# Altium project Relia ver2.PrjPcb (part 1 of 2)
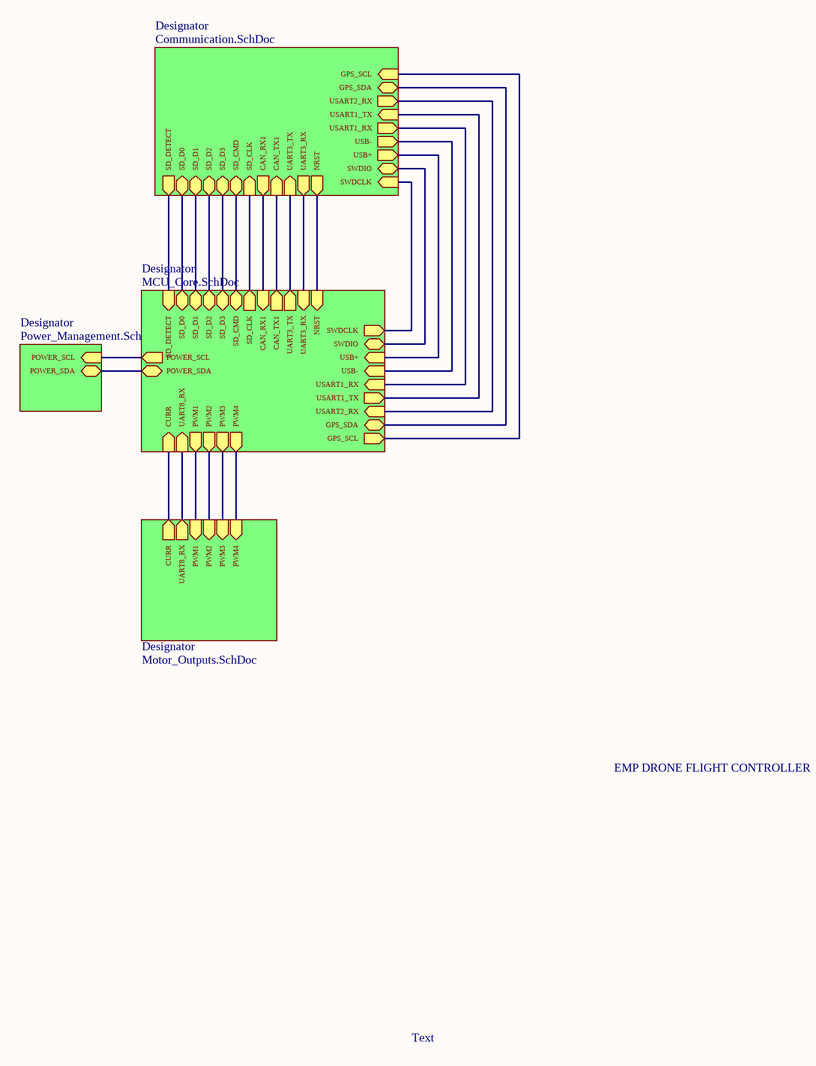
[diagram p0: EMP_FC_Main.SchDoc]
5 sheets, 143 parts. Net scope: hierarchical (ports join the sheet entries above them; power ports are global).
Board files: RELIA.PcbDoc, Relia_6_Layer.PcbDoc
Sheets:
  EMP_FC_Main.SchDoc
    Designator = Power_Management.SchDoc
    Designator = MCU_Core.SchDoc
    Designator = Communication.SchDoc
    Designator = Motor_Outputs.SchDoc

## Sheet EMP_FC_Main.SchDoc
size A4; SheetNumber: 1; SheetTotal: 5

### Sub-sheets
Designator = Power_Management.SchDoc: POWER_SCL (in), POWER_SDA (bidir)
Designator = MCU_Core.SchDoc: PWM4 (out), CURR (in), UART8_RX (in), PWM1 (out), PWM2 (out), PWM3 (out), NRST (in), UART3_RX (in), UART3_TX (out), CAN_TX1 (out), CAN_RX1 (in), SD_CMD (bidir), SD_CLK (out), SD_D3 (bidir), SD_D2 (bidir), SD_D1 (bidir), SD_D0 (bidir), POWER_SCL (out), POWER_SDA (bidir), SWDCLK (out), SWDIO (bidir), USB+ (in), USB- (in), USART1_RX (in), USART1_TX (out), USART2_RX (in), GPS_SDA (bidir), GPS_SCL (out), SD_DETECT (in)
Designator = Communication.SchDoc: SD_D0 (bidir), SD_D1 (bidir), SD_D2 (bidir), SD_D3 (bidir), SD_CMD (bidir), SD_CLK (in), CAN_RX1 (out), CAN_TX1 (in), UART3_TX (in), UART3_RX (out), NRST (out), USART2_RX (out), SWDCLK (in), SWDIO (bidir), USB+ (out), USB- (out), USART1_RX (out), USART1_TX (in), GPS_SDA (bidir), GPS_SCL (in), SD_DETECT (out)
Designator = Motor_Outputs.SchDoc: PWM4 (in), CURR (out), UART8_RX (out), PWM1 (in), PWM2 (in), PWM3 (in)

### Nets
GPS_SCL: sheet Designator/GPS_SCL, sheet Designator/GPS_SCL
GPS_SDA: sheet Designator/GPS_SDA, sheet Designator/GPS_SDA
NRST: sheet Designator/NRST, sheet Designator/NRST
RX: sheet Designator/UART8_RX, sheet Designator/UART8_RX
SD_CLK: sheet Designator/SD_CLK, sheet Designator/SD_CLK
SD_CMD: sheet Designator/SD_CMD, sheet Designator/SD_CMD
SD_D1: sheet Designator/SD_D1, sheet Designator/SD_D1
SD_D2: sheet Designator/SD_D2, sheet Designator/SD_D2
SD_D3: sheet Designator/SD_D3, sheet Designator/SD_D3
SD_DETECT: sheet Designator/SD_DETECT, sheet Designator/SD_DETECT
SD_DO: sheet Designator/SD_D0, sheet Designator/SD_D0
SWCLK: sheet Designator/SWDCLK, sheet Designator/SWDCLK
SWDIO: sheet Designator/SWDIO, sheet Designator/SWDIO
UART3_RX: sheet Designator/UART3_RX, sheet Designator/UART3_RX
UART3_TX: sheet Designator/UART3_TX, sheet Designator/UART3_TX
USART1_RX: sheet Designator/USART1_RX, sheet Designator/USART1_RX
USART1_TX: sheet Designator/USART1_TX, sheet Designator/USART1_TX
USB_N: sheet Designator/USB-, sheet Designator/USB-
USB_P: sheet Designator/USB+, sheet Designator/USB+
NetC39_1: sheet Designator/CURR, sheet Designator/CURR
NetJ8_1: sheet Designator/POWER_SCL, sheet Designator/POWER_SCL
NetJ8_2: sheet Designator/POWER_SDA, sheet Designator/POWER_SDA
NetR11_1: sheet Designator/USART2_RX, sheet Designator/USART2_RX
NetR29_1: sheet Designator/PWM1, sheet Designator/PWM1
NetR30_1: sheet Designator/PWM2, sheet Designator/PWM2
NetR31_1: sheet Designator/PWM3, sheet Designator/PWM3
NetR32_1: sheet Designator/PWM4, sheet Designator/PWM4
NetU2_1: sheet Designator/CAN_TX1, sheet Designator/CAN_TX1
NetU2_4: sheet Designator/CAN_RX1, sheet Designator/CAN_RX1

### Notes on the sheet
- EMP DRONE FLIGHT CONTROLLER
- Text

## Sheet Power_Management.SchDoc
size A3; SheetNumber: 2; SheetTotal: 5
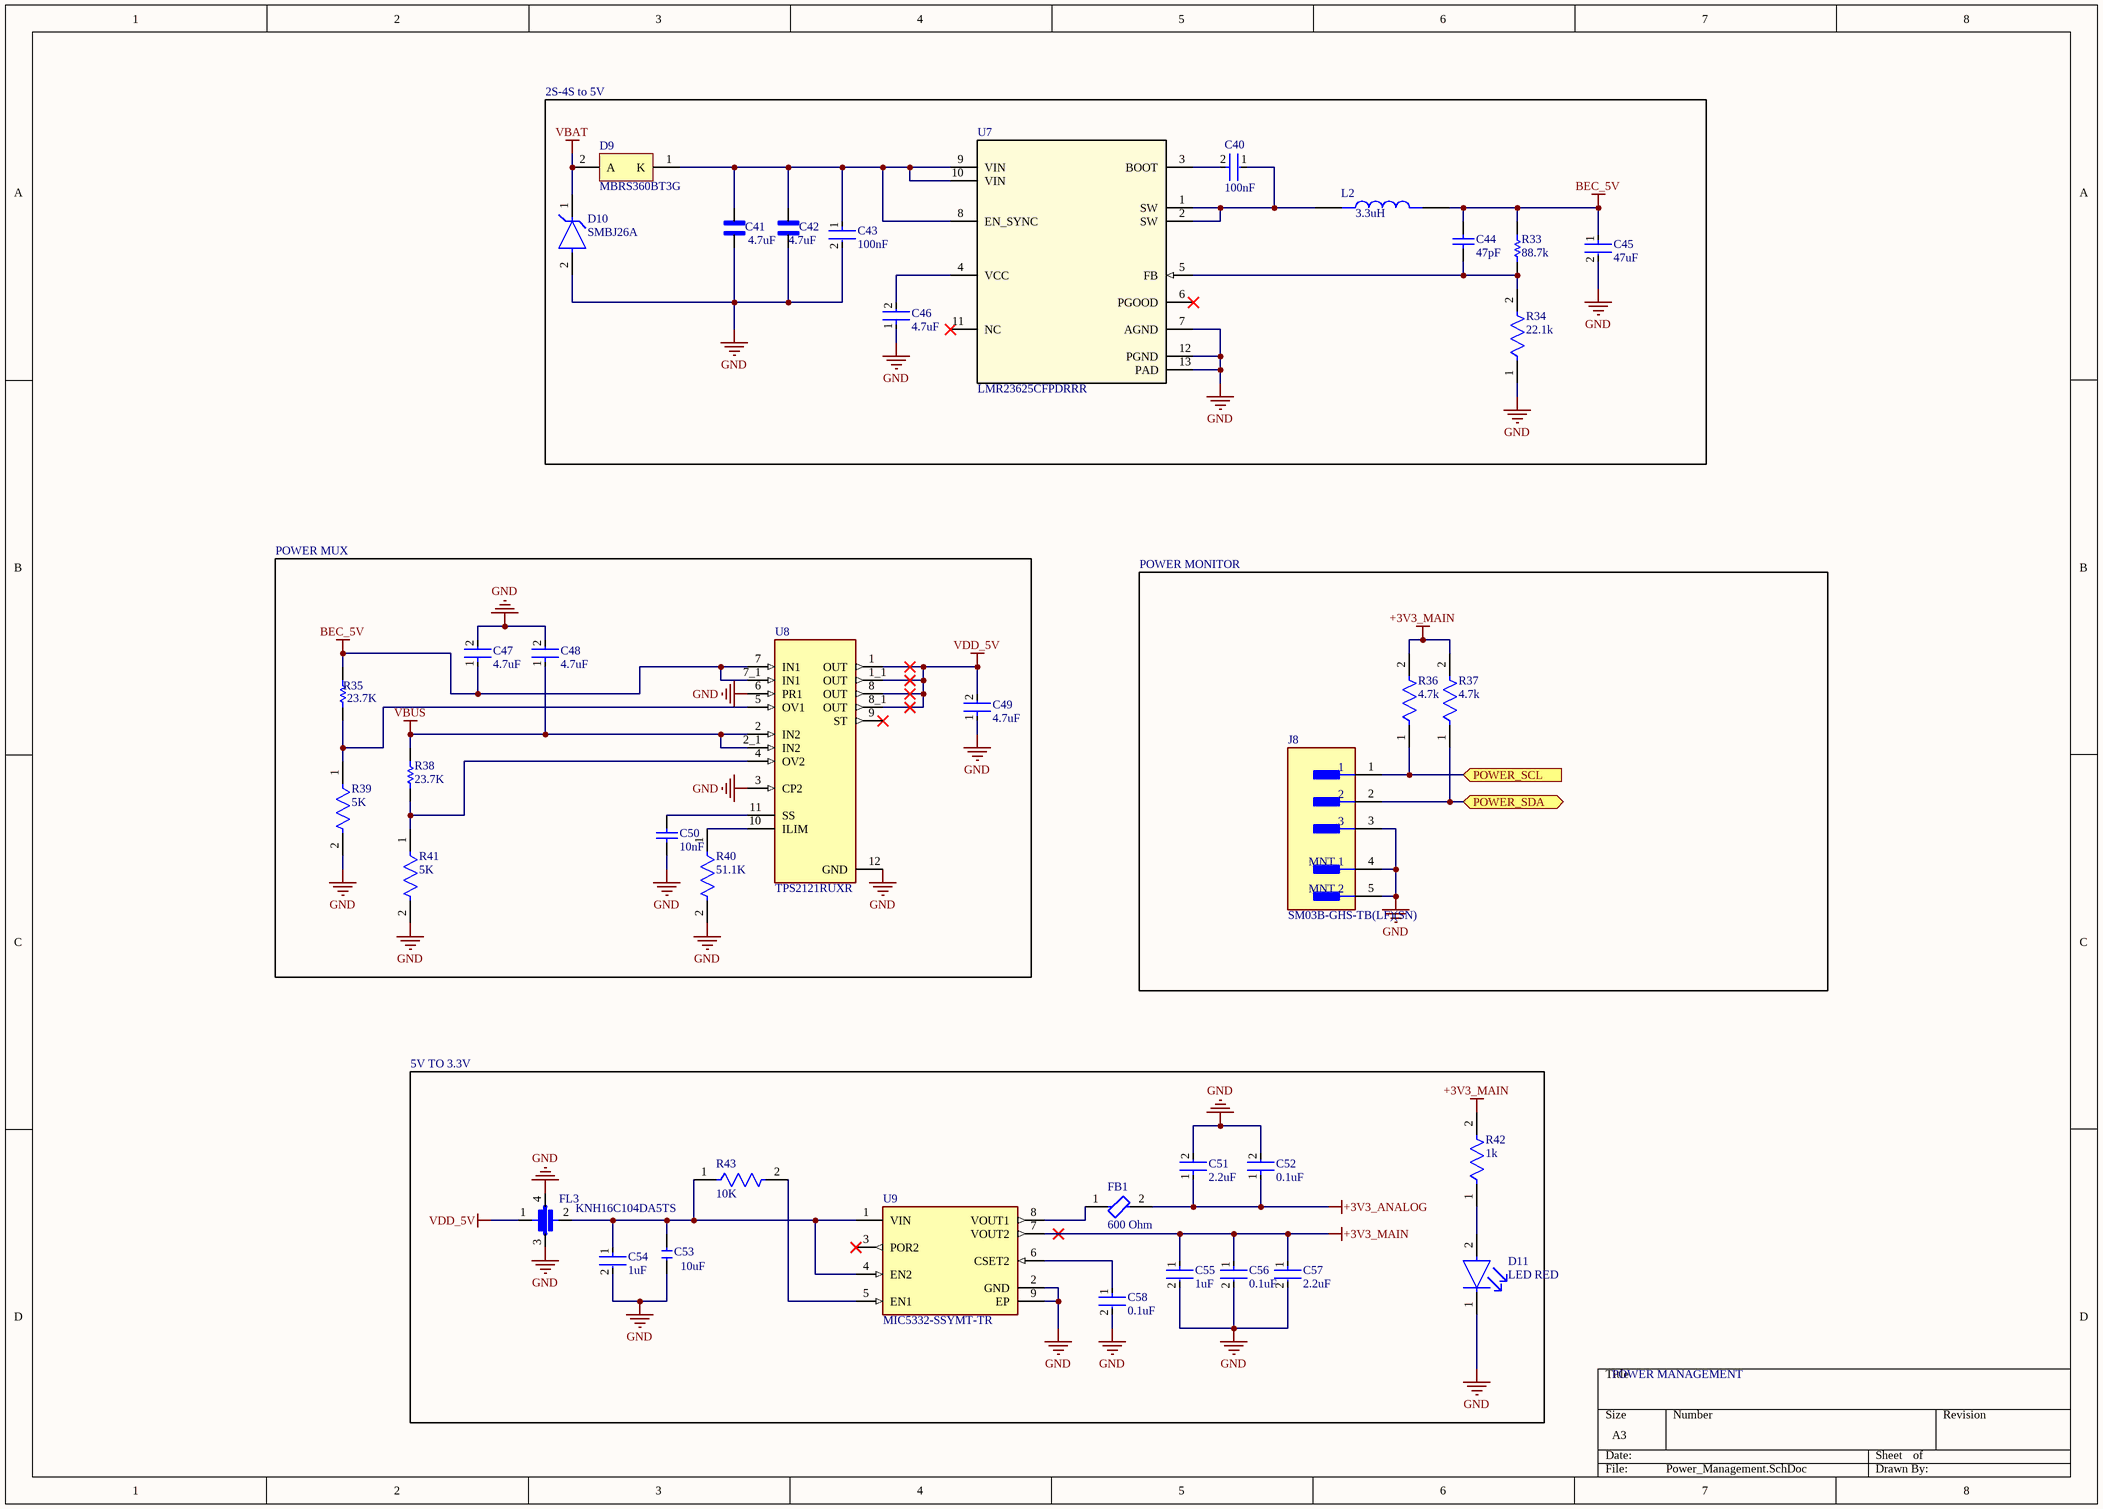
[diagram p1: Power_Management.SchDoc]

### Parts
C40  100nF  [FP-GRM15-MFG]
C41  MSASU32MSB7475MPNA01  [CAPC3225X270N]  (value not drawn)
C42  MSASU32MSB7475MPNA01  [CAPC3225X270N]  (value not drawn)
C43  100nF  [FP-CS0402-CA-MFG]
C44  47pF  [CAPC1005X55X25NL05T10]
C45  47uF  [FP-GRM31C-0_2-e0_3_0_8-IPC_A]
C46  4.7uF  [FP-GRT155-0_15-MFG]
C47  4.7uF  [FP-GRT155-0_15-MFG]
C48  4.7uF  [FP-GRT155-0_15-MFG]
C49  4.7uF  [FP-GRT155-0_15-MFG]
C50  10nF  [CAPC1005X60X30NL05T10]
C51  2.2uF  [FP-GRM155-0_2-IPC_B]
C52  0.1uF  [FP-C0402-BB-MFG]
C53  GRM155R60J106ME15D  [C0402]  (value not drawn)
C54  1uF  [FP-GRM155-0_1-IPC_A]
C55  1uF  [FP-GRM155-0_1-IPC_A]
C56  0.1uF  [FP-C0402-BB-MFG]
C57  2.2uF  [FP-GRM155-0_2-IPC_B]
C58  0.1uF  [FP-C0402-BB-MFG]
D9  MBRS360BT3G  [ONSC-SMB-2-403A-03_H_V]
D10  SMBJ26A  [FP-SMBJ-MFG]
D11  LED RED  [FP-SML-LXT0805IW-TR-MFG]
FB1  600 Ohm  [FP-BLM15-0_05-MFG]
FL3  KNH16C104DA5TS  [FIL_KNH16C104DA5TS]
J8  SM03B-GHS-TB(LF)(SN)  [FP-SM03B-GHS-TB_LF_SN-MFG]
L2  IND_XAL4030-332MEB  [IND_XAL4030-332MEB]  (value not drawn)
R33  88.7k  [RESC1005X40X25NL05T05]
R34  22.1k  [FP-CRCW0402-e3-IPC_A]
R35  23.7K  [RESC1005X40X25LL05T05]
R36  4.7k  [FP-TFCR0402-IPC_A]
R37  4.7k  [FP-TFCR0402-IPC_A]
R38  23.7K  [RESC1005X40X25LL05T05]
R39  5K  [FP-PNM0402-IPC_C]
R40  51.1K  [FP-RK73H1E-IPC_C]
R41  5K  [FP-PNM0402-IPC_C]
R42  1k  [FP-MCS0402-IPC_A]
R43  10K  [FP-MCS0402-MFG]
U7  LMR23625CFPDRRR  [DRR0012D]
U8  TPS2121RUXR  [IC_TPS2121RUXR]
U9  MIC5332-SSYMT-TR  [FP-MIC5332-SSYMT-TR-IPC_C]

### Blocks framed on the sheet
POWER MUX: C47-C50 R35 R38-R41 U8
POWER MONITOR: J8 R36 R37

### Ports
POWER_SCL (in, see EMP_FC_Main[2B], MCU_Core[1B]), POWER_SDA (bidir, see EMP_FC_Main[2C], MCU_Core[1B])

### Nets
+3V3_ANALOG: C51.1 C52.1 FB1.2
+3V3_MAIN: C55.1 C56.1 C57.1 R36.2 R37.2 R42.2 U9.7(VOUT2)
BEC_5V: C44.2 C45.1 C47.1 L2.2 R33.2 R35.2 U8.7(IN1) U8.7_1(IN1)
GND: C41.1 C42.1 C43.2 C45.2 C46.1 C47.2 C48.2 C49.1 C50.1 C51.2 C52.2 C53.1 C54.2 C55.2 C56.2 C57.2 C58.2 D10.2(A) D11.1(C) FL3.3 FL3.4 J8.3 J8.4(MNT_1) J8.5(MNT_2) R34.1 R39.2 R40.2 R41.2 U7.7(AGND) U7.12(PGND) U7.13(PAD) U8.3(CP2) U8.6(PR1) U8.12(GND) U9.2(GND) U9.9(EP)
VBAT: D9.2(A) D10.1(C)
VBUS: C48.1 R38.2 U8.2(IN2) U8.2_1(IN2)
VDD_5V: C49.2 FL3.1 U8.1(OUT) U8.1_1(OUT) U8.8(OUT) U8.8_1(OUT)
NetC40_1: C40.1 L2.1 U7.1(SW) U7.2(SW)
NetC40_2: C40.2 U7.3(BOOT)
NetC41_2: C41.2 C42.2 C43.1 D9.1(K) U7.8(EN_SYNC) U7.9(VIN) U7.10(VIN)
NetC44_1: C44.1 R33.1 R34.2 U7.5(FB)
NetC46_2: C46.2 U7.4(VCC)
NetC50_2: C50.2 U8.11(SS)
NetC53_2: C53.2 C54.1 FL3.2 R43.1 U9.1(VIN) U9.4(EN2)
NetC58_1: C58.1 U9.6(CSET2)
NetD11_2: D11.2(A) R42.1
NetFB1_1: FB1.1 U9.8(VOUT1)
NetJ8_1: J8.1 R36.1 ; port POWER_SCL
NetJ8_2: J8.2 R37.1 ; port POWER_SDA
NetR35_1: R35.1 R39.1 U8.5(OV1)
NetR38_1: R38.1 R41.1 U8.4(OV2)
NetR40_1: R40.1 U8.10(ILIM)
NetR43_2: R43.2 U9.5(EN1)

Not connected (* = marked no-connect by the designer): U7 6(PGOOD)* 11(NC)*; U8 9(ST)*; U9 3(POR2)*

### Notes on the sheet
- 2S-4S to 5V
- 4.7uF
- (near C42) 4.7uF
- (near L2) 3.3uH
- 5V TO 3.3V
- (near C53) 10uF
- POWER MANAGEMENT

### Library data of the parts
C40 = CMP-2100-03641-2: CAP CER 0.1UF 16V X7R 0402; Manufacturer Part Number: GRM155R71C104KA88D; Manufacturer: Murata; Standoff Height: 0mm; Tolerance: 10%; Voltage Rating: 16Vdc; Material: Ceramic; Capacitance: 0.10μF; Value: 0.10μF; RoHS: TRUE; Temperature Characteristic: X7R; Octopart: https://octopart.com/grm155r71c104ka88d-murata-196880; Digikey Description: CAP CER 0.1UF 16V X7R 0402; Device Class L3: Ceramic Capacitors; Height: 0.55mm; ComponentLink2Description: Datasheet; Temperature Range Low: -55°C; Ipc Land Pattern Name: CAPC10050X219; ComponentLink2URL: https://search.murata.co.jp/Ceramy/image/img/A01X/G101/ENG/GRM155R71H471KA01-01A.pdf; Device Class L1: Passive Components; Lead Free: yes; Category: Cap; Package: GRM15; Temperature: -55°C to +125°C; Device Class L2: Capacitors; Temperature Range High: +125°C; Mouser Description: 0402 0.1 uF 16V ±10 % Tolerance X7R SMT Multilayer Ceramic Capacitor
C41 C42 = MSASU32MSB7475MPNA01: MF: {'manufacturer': u'Taiyo Yuden'}; Package: None; Price: None; Value: *; MP: MSASU32MSB7475MPNA01; Availability: Unavailable
C43 = CMP-00621-74602085-1: CS0402KRX7R8BB104 Multilayer Ceramic Capacitor, 0.1 uF, 25 V, ± 10%, X7R, 0402 [1005 Metric]; Voltage Rating: 25V; Capacitance: 100nF; Material: Ceramic; Thickness: 660.4µm; Features: Soft Termination; Max Operating Temperature: 125°C; Mount: Surface Mount; Min Operating Temperature: -55°C; Length: 990.6µm; Height: 650µm; Width: 508µm; Tolerance: 10%; Case/Package: 0402; NexarPartId: 74602085; RoHS: Compliant
C44 = CMP-2008-04203-1: Part Number: GRM1555C1E470JA01D; Manufacturer: Murata
C45 = CMP-06035-007919-1: Chip Multilayer Ceramic Capacitors for General Purpose, 1206, 47uF, X5R, 15%, 10%, 10V; Width: 0.063inch; Thickness: 0.071inch; Max Operating Temperature: 85°C; Min Operating Temperature: -55°C; Length: 3.2mm; Case Code (Metric): 3216; Resistor Type: Ceramic; Packaging: Tape and Reel; Weight: 0.001411oz; Case Code (Imperial): 1206; Mount: Surface Mount; Depth: 1.6mm; Capacitance: 47uF; Package Quantity: 6000; Height: 1.6mm; Case/Package: 1206; Tolerance: 10%; Dielectric: X5R; Voltage Rating: 10V; Voltage Rating (DC): 10V; Termination: SMD/SMT
C46-C49 = CMP-06035-058540-1: Multi-Layer Ceramic Capacitor 4.7uF 10V X5R ±20% 0402 Paper T/R
C50 = CMP-2008-02101-1: Part Number: C0402C103K3RALTU; Manufacturer: Kemet
C51 C57 = CMP-06035-053544-1: Chip Multilayer Ceramic Capacitors for General Purpose, 0402, 2.2uF, X7R, 15%, 10%, 10V
C52 C56 C58 = CMP-03020-002733-1: CAP CER 0.1UF 10V X7R 0402; Manufacturer: Kemet; Manufacturer Part Number: C0402C104K8RACAUTO; Material: Ceramic; Value: 0.10 μF; Tolerance: 0.1; Temperature Coefficient: 15%; ComponentLink2Description: Datasheet; Automotive: No; Digikey Description: CAP CER 0.1UF 10V X7R 0402; Temperature Range Low: -55°C; Ipc Land Pattern Name: CAPC10050X50; Lead Free: Yes; Category: Cap; Package: C0402-BB; Octopart: https://octopart.com/c0402c104k8racauto-kemet-9145167; Voltage Rating: 10 V; Device Class L2: Capacitors; Capacitance: 0.10 μF; Temperature Range High: +125°C; Height: 0.55mm; ComponentLink2URL: https://content.kemet.com/datasheets/KEM_C1002_X7R_SMD.pdf; Temperature: -55°C to +125°C; Device Class L1: Passive Components; Temperature Characteristic: X7R; RoHS: TRUE; Device Class L3: Ceramic Capacitors
C53 = CERAMIC-10UF-6.3V-20%-X5R(0402): 10 ÂµF Â±20% 6.3V Ceramic Capacitor X5R 0402 (1005 Metric); Value: 10uF; MF: Yageo; MP: CC0402MRX5R5BB106; SnapEDA_Link: https://www.snapeda.com/parts/CC0402MRX5R5BB106/Yageo/view-part/?ref=snap; Package: 0402 Yageo; Check_prices: https://www.snapeda.com/parts/CC0402MRX5R5BB106/Yageo/view-part/?ref=eda
C54 C55 = CMP-06035-012596-1: Chip Multilayer Ceramic Capacitors for General Purpose, 0402, 1.0uF, X7R, 15%, 10%, 10V
D9 = CMP-1055-00339-1: Schottky Power Rectifier, 2-Pin SMB, Pb-Free, Tape and Reel; Manufacturer: On Semiconductor; Configuration: Single; IFSM Max (A): 125; ComponentLink3Description: Package Specification; ComponentLink2Description: Datasheet; DatasheetVersion: Rev. 8; ComponentLink2URL: http://www.onsemi.cn/pub_link/Collateral/MBRS360T3-D.PDF; ComponentLink3URL: http://www.onsemi.com/pub_link/Collateral/1SMB5913BT3-D.PDF; PackageReference: SMB-2-403A-03_H; PackageVersion: Rev. H, 05/2011; ComponentLink1URL: http://www.onsemi.com/; Packing: Tape and Reel; RoHS: TRUE; PartNumber: MBRS360BT3G; PackageDescription: 2-Pin Small Molded Package, J-Bend Lead, Body 4.33 x 3.625 mm; Mounting Technology: Surface Mount; ComponentLink1Description: Manufacturer URL
D10 = CMP-08607-000063-1: TVS DIODE 26V 42.1V DO214AA; Manufacturer: Littelfuse; Breakdown Voltage: 28.9V; Peak Pulse Power: 600W; Peak Pulse Current: 14.3A; Direction: Unidirectional; Number Of Channels: 1; Max Junction Temp: +150°C; Lead Free: Yes; Device Class L1: Circuit Protection; Height: 2.61mm; Device Class L3: unset; Reverse Standoff Voltage: 26V; ComponentLink2URL: https://www.littelfuse.com/~/media/electronics/datasheets/tvs_diodes/littelfuse_tvs_diode_smbj_datasheet.pdf.pdf; Automotive: No; Octopart: https://octopart.com/smbj26a-littelfuse-350771; Device Class L2: TVS Diodes; Clamping Voltage: 42.1V; Manufacturer Part Number: SMBJ26A; Temperature Range High: +150°C; Category: Diode; RoHS: TRUE; Temperature: -65°C to +150°C; Mouser Description: TVS Diodes - Transient Voltage Suppressors 26Vr 600W 14.3A 5% UniDirectional; Package: SMBJ; Digikey Description: TVS DIODE 26V 42.1V DO214AA; Temperature Range Low: -65°C; ComponentLink2Description: Datasheet
D11 = CMP-1724-00002-2: LED RED DIFFUSED SMD; Lens Style: Rectangular; Luminous Intensity: 11mcd; Approvals: UL; Test Current: 20mA; Forward Voltage: 2V; Number of LEDs: 1; Wavelength: 635nm; Lens Color: White; Viewing Angle: 140°; Min Operating Temperature: -25°C; Case Code (Metric): 2012; Mount: Surface Mount; Case Code (Imperial): 0805; Height: 0.8mm; Lead Free: Lead Free; Color: Red; Package Quantity: 1; Illumination Color: Red; Lens Transparency: Diffused; Forward Current: 20mA; Packaging: Tape and Reel; Length: 2mm; Case/Package: 0805; REACH SVHC: No SVHC; Width: 1.25mm; Number of Pins: 2; Max Operating Temperature: 80°C; Dominant Wavelength: 635nm
FB1 = CMP-00260-117051428-1: BLM15PE601SH1D Ferrite Bead, 600 Ohm, 25%, 0402 Rohs Compliant: Yes; Test Frequency: 100MHz; Resistance: 400mΩ; RMS Current (Irms): 700mA; Tolerance: 25%; Height: 550µm; Lifecycle Status: Production; NexarPartId: 117051428; Case/Package: 0402; Min Operating Temperature: -55°C; Series Resistance: 400mΩ; Max Operating Temperature: 125°C; Core Material: Ferrite
FL3 = KNH16C104DA5TS: MF: {'manufacturer': u'KYOCERA AVX'}; Package: None; Price: None; Value: *; MP: KNH16C104DA5TS; Availability: Unavailable
J8 = CMP-17439-000068-1: CONN HEADER SMD R/A 3POS 1.25MM; Voltage Rating: 50V; Wire/Cable Gauge: 26AWG; Pitch: 0.049inch; Gender: Male; Number of Positions: 3; Current Rating: 1A; Orientation: Right Angle; REACH SVHC: No SVHC; Insulation Color: Natural; Housing Material: Nylon; Mount: Surface Mount; Flammability Rating: UL94 V-0; Color: Natural; Number of Rows: 1; Housing Color: Natural; Termination: Solder; Voltage Rating (AC): 50V; Max Operating Temperature: 85°C; Connector Type: Header; Series: GH; Packaging: Tape and Reel; Contact Finish - Mating: TIN; Lead Free: Lead Free; Fastening Type: Ramp; Contact Plating: Tin; Contact Material: Bronze; Insulation Material: Nylon; Contact Type: Outer Shroud Contact; Number of Contacts: 3; Min Operating Temperature: -25°C; Contact Shape: Rectangular
L2 = XAL4030-332MEB: Package: None; Price: None; Value: *; MP: XAL4030-332MEB; Availability: Unavailable
R33 = CMP-2002-00251-1: Manufacturer: Vishay Dale; Part Number: CRCW040288K7FKED
R34 = CMP-2002-08380-2: RES Thick Film, 22.1kΩ, 1%, 0.063W, 100ppm/°C, 0402; Voltage Rating: 50V; Resistance: 22.1kR; Power Rating: 63mW; Length: 1mm; Termination: SMD/SMT; Height: 0.35mm; Package Quantity: 10000; Depth: 0.5mm; Lead Free: Lead Free; Packaging: Tape and Reel; Case/Package: 0402; Max Operating Temperature: 155°C; Composition: Thick Film; Min Operating Temperature: -55°C; Working Voltage: 50V; Number of Pins: 2; Contact Plating: Tin; Mount: Surface Mount; Case Code (Imperial): 0402; Temperature Coefficient: 100ppm/°C; Tolerance: 1%; Voltage Rating (DC): 50V; Width: 0.5mm; Number of Terminations: 2; Radiation Hardening: No; Weight: 2.3E-05oz; Military Standard: Not; Case Code (Metric): 1005
R35 R38 = CMP-2002-00388-1: Manufacturer: Vishay Dale; Part Number: CRCW040223K7FKTD
R36 R37 = CMP-250906-194630-1: RES Thin Film,  4.7kΩ, 0.5%, 0.063W, 25ppm/°C, 0402
R39 R41 = CMP-02407-012302-1: RES SMD 5K OHM 0.1% 1/20W 0402; Temperature Coefficient: 25ppm/°C; Resistance: 5kR; Max Power Dissipation: 50mW; Width: 0.022inch; Height: 0.033inch; Tolerance: 0.1%; Number of Terminations: 2; Packaging: Tape and Reel; RoHS Compliant: Yes; Case Code (Imperial): 0402; Min Operating Temperature: -55°C; Case Code (Metric): 1005; Features: Moisture Resistant; Max Operating Temperature: 155°C; Package Quantity: 1000; Resistor Type: Thin Film; Length: 0.042inch; Case/Package: 0402
R40 = CMP-04015-106274-1: 51.1kΩ ±1% 0.1W Chip Resistor 0402 Thick Film AEC-Q200 Qualified; Voltage Rating: 50V; Resistance: 51.1kR; Temperature Coefficient: 100ppm/°C; Power Rating: 63mW; Series: RK73H; Min Operating Temperature: -55°C; Construction: Rectangular; Length: 1mm; Case Code (Imperial): 0402; Case Code (Metric): 1005; Voltage Rating (DC): 50V; Tolerance: 1%; Lead Free: Contains Lead; Width: 0.5mm; Height: 0.35mm; Military Standard: Not; Packaging: Tape and Reel; Package Quantity: 10000; Case/Package: 0402; Max Operating Temperature: 155°C; Termination: SMD/SMT; Resistor Type: Thick Film; RoHS Compliant: No; Depth: 0.5mm
R42 = CMP-02407-001712-1: RES SMD 1.2K OHM 1% 1/10W 0402; Tolerance: 0.5%; Temperature Coefficient: 25ppm/°C; Max Power Dissipation: 200mW; Resistance: 1kR; Case Code (Metric): 1005; Min Operating Temperature: -55°C; Max Operating Temperature: 175°C; Features: Automotive AEC-Q200; Composition: Thin Film; Case Code (Imperial): 0402; Number of Terminations: 2; Case/Package: 0402; Packaging: Cut Tape
R43 = CMP-02407-000363-1: RES SMD 1.2K OHM 1% 1/10W 0402; Power Rating: 100mW; Temperature Coefficient: 25ppm/°C; Tolerance: 0.5%; Voltage Rating: 50V; Resistance: 10kR; Value: 10kR; Package Quantity: 10000; Case Code (Metric): 1005; Height: 0.015inch; Termination: SMD/SMT; Features: Automotive AEC-Q200; Packaging: Tape and Reel; Length: 0.039inch; Min Operating Temperature: -55°C; Case/Package: 0402; Max Power Dissipation: 100mW; Case Code (Imperial): 0402; Width: 0.5mm; Contact Plating: Tin; Weight: 2.1E-05oz; Max Operating Temperature: 175°C; Composition: Thin Film; Number of Terminations: 2; Radiation Hardening: No
U7 = LMR23625CFPDRRR: SIMPLE SWITCHERÂ®, 36V 2.5A Synchronous Step-Down Converter 12-WSON -40 to 125; Manufacturer_Name: Texas Instruments; TYPE: TYPE; RefDes: RefDes; Copyright: Copyright (C) 2025 Ultra Librarian. All rights reserved.; Manufacturer_Part_Number: LMR23625CFPDRRR; Datasheet: https://www.ti.com/lit/gpn/lmr23625
U8 = TPS2121RUXR: 2.7-V&nbsp;to 22-V, 56-mâ„¦, 4.5-A, power mux with seamless switchover; MF: Texas Instruments; Package: VQFN-HR-12 Texas Instruments; Price: None; Check_prices: https://www.snapeda.com/parts/TPS2121RUXR/Texas+Instruments/view-part/?ref=eda; Value: *; SnapEDA_Link: https://www.snapeda.com/parts/TPS2121RUXR/Texas+Instruments/view-part/?ref=snap; MP: TPS2121RUXR; Availability: In Stock; Purchase-URL: https://pricing.snapeda.com/search?q=TPS2121RUXR&ref=eda
U9 = CMP-06324-000082-1: IC REG LINEAR 3.3V/3.3V 8TMLF; Dropout Voltage: 120mV; Output Current: 300mA; Number of Outputs: 2; Output Voltage: 3.3V; Min Current Limit: 350mA; Min Input Voltage: 2.3V; Polarity: Positive; Output Voltage Accuracy: 1%; Packaging: Tape and Reel; Min Operating Temperature: -40°C; Series: -; Mount: Surface Mount; Max Operating Temperature: 125°C; Package Quantity: 1; RoHS Compliant: Yes; Number of Regulators: 2; Number of Pins: 8

## Sheet MCU_Core.SchDoc
size A3; SheetNumber: 3; SheetTotal: 5
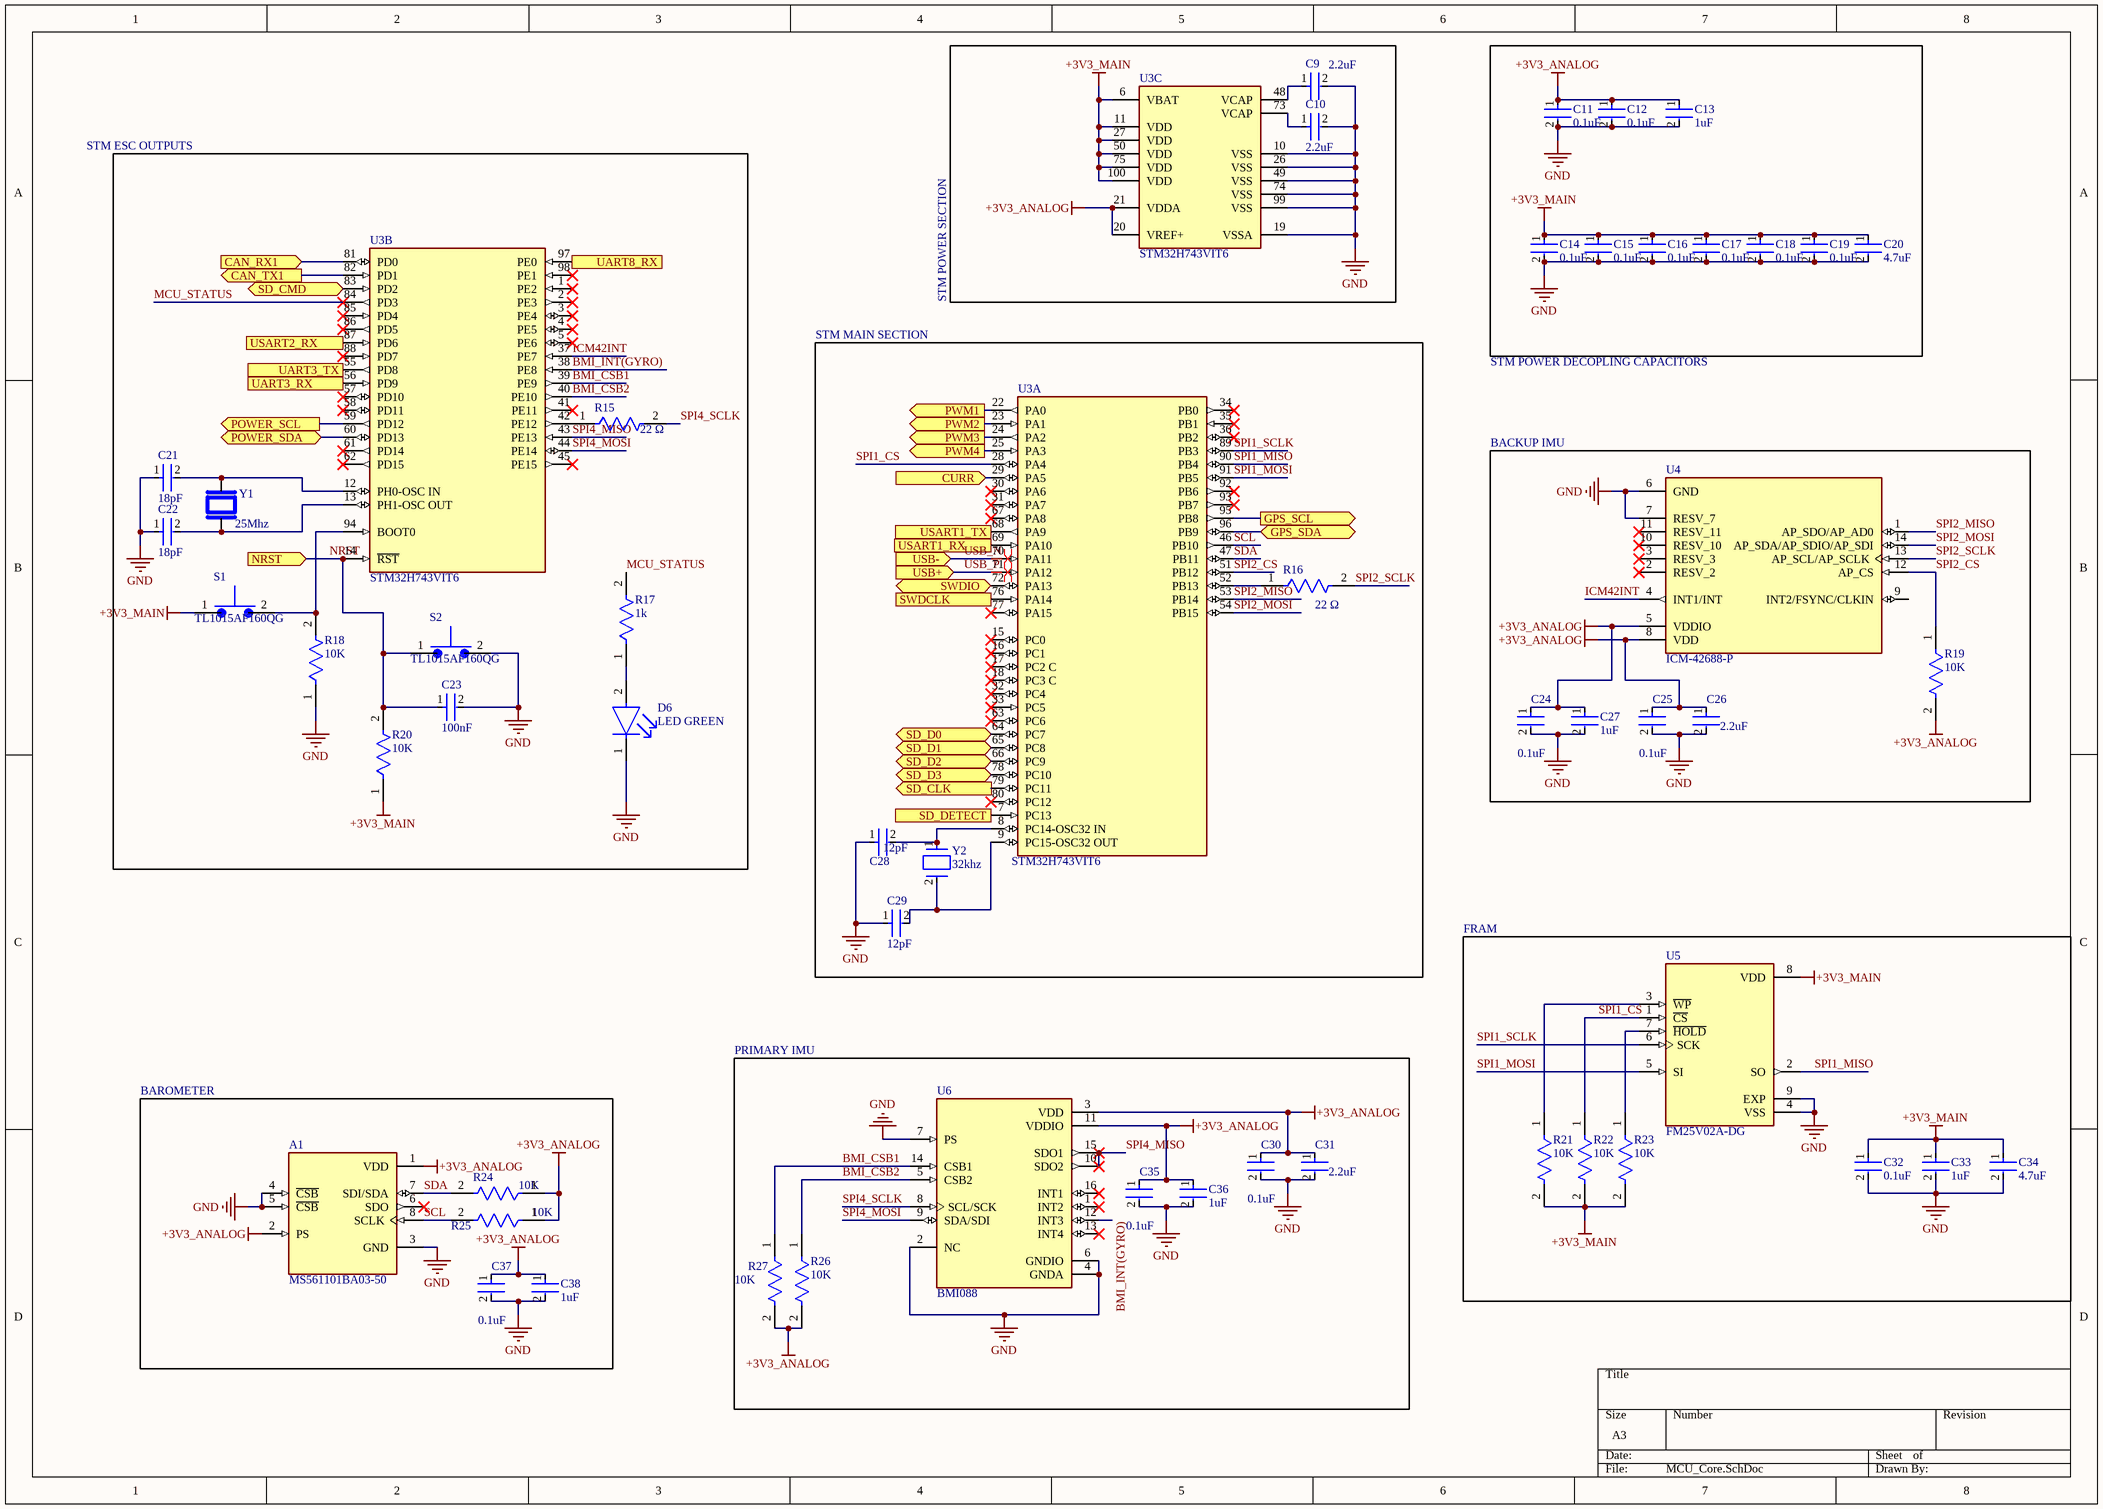
[diagram p2: MCU_Core.SchDoc]

### Parts
A1  MS561101BA03-50  [XDCR_MS561101BA03-50]
C9  2.2uF  [FP-GRM155-0_15-IPC_A]
C10  2.2uF  [FP-GRM155-0_15-IPC_A]
C11  0.1uF  [FP-C0402-BB-MFG]
C12  0.1uF  [FP-C0402-BB-MFG]
C13  1uF  [FP-GRM155-0_05-IPC_B]
C14  0.1uF  [FP-C0402-BB-MFG]
C15  0.1uF  [FP-C0402-BB-MFG]
C16  0.1uF  [FP-C0402-BB-MFG]
C17  0.1uF  [FP-C0402-BB-MFG]
C18  0.1uF  [FP-C0402-BB-MFG]
C19  0.1uF  [FP-C0402-BB-MFG]
C20  4.7uF  [FP-GRT155-0_15-MFG]
C21  18pF  [FP-C0402-BB-MFG]
C22  18pF  [FP-C0402-BB-MFG]
C23  100nF  [FP-C0402-BB-MFG]
C24  0.1uF  [FP-C0402-BB-MFG]
C25  0.1uF  [FP-C0402-BB-MFG]
C26  2.2uF  [FP-GRM155-0_15-IPC_A]
C27  1uF  [FP-GRM155-0_05-IPC_B]
C28  12pF  [FP-C0402-BB-MFG]
C29  12pF  [FP-C0402-BB-MFG]
C30  0.1uF  [FP-C0402-BB-MFG]
C31  2.2uF  [FP-GRM155-0_15-IPC_A]
C32  0.1uF  [FP-C0402-BB-MFG]
C33  1uF  [FP-GRM155-0_05-IPC_B]
C34  4.7uF  [FP-GRT155-0_15-MFG]
C35  0.1uF  [FP-C0402-BB-MFG]
C36  1uF  [FP-GRM155-0_05-IPC_B]
C37  0.1uF  [FP-C0402-BB-MFG]
C38  1uF  [FP-GRM155-0_05-IPC_B]
D6  LED GREEN  [FP-LTST-C171GKT-MFG]
R15  22 Ω  [FP-RMCF0402-MFG]
R16  22 Ω  [FP-RMCF0402-MFG]
R17  1k  [FP-MCS0402-IPC_A]
R18  10K  [FP-MCS0402-MFG]
R19  10K  [FP-MCS0402-MFG]
R20  10K  [FP-MCS0402-MFG]
R21  10K  [FP-MCS0402-MFG]
R22  10K  [FP-MCS0402-MFG]
R23  10K  [FP-MCS0402-MFG]
R24  10K  [FP-MCS0402-MFG]
R25  10K  [FP-MCS0402-MFG]
R26  10K  [FP-MCS0402-MFG]
R27  10K  [FP-MCS0402-MFG]
S1  TL1015AF160QG  [SW_TL1015AF160QG]
S2  TL1015AF160QG  [SW_TL1015AF160QG]
U3  STM32H743VIT6  [FP-LQFP100-1L-MFG]  (parts A,B,C of 3)
U4  ICM-42688-P  [PQFN50P300X250X97-14N]
U5  FM25V02A-DG  [SON95P450X400X80-9N]
U6  BMI088  [PQFN50P450X300X100-16N]
Y1  ABM8N-25.0000MHZ-12-B1U-T3  [XTAL_SXT32412BB07-25.000MT]  (value not drawn)
Y2  32khz  [FP-ABS07-MFG]

### Blocks framed on the sheet
STM POWER SECTION: C9 C10 U3
25Mhz: C21-C23 D6 R15 R17 R18 R20 S1 S2 U3 Y1
STM MAIN SECTION: C28 C29 R16 U3 Y2
BACKUP IMU: C24-C27 R19 U4
FRAM: C32-C34 R21-R23 U5
BAROMETER: A1 C37 C38 R24 R25
PRIMARY IMU: C30 C31 C35 C36 R26 R27 U6

### Ports
CAN_RX1 (in, see EMP_FC_Main[2B], Communication[2D]), CAN_TX1 (out, see EMP_FC_Main[2B], Communication[2C]), CURR (in, see EMP_FC_Main[2C], Motor_Outputs[2B]), GPS_SCL (out, see EMP_FC_Main[3C], Communication[8C]), GPS_SDA (bidir, see EMP_FC_Main[3C], Communication[8C]), NRST (in, see EMP_FC_Main[3B], Communication[8A]), POWER_SCL (out, see EMP_FC_Main[2B], Power_Management[6C]), POWER_SDA (bidir, see EMP_FC_Main[2C], Power_Management[6C]), PWM1 (out, see EMP_FC_Main[2C], Motor_Outputs[3B]), PWM2 (out, see EMP_FC_Main[2C], Motor_Outputs[3B]), PWM3 (out, see EMP_FC_Main[2C], Motor_Outputs[3B]), PWM4 (out, see EMP_FC_Main[2C], Motor_Outputs[3B]), SD_CLK (out, see EMP_FC_Main[2B], Communication[5B]), SD_CMD (bidir, see EMP_FC_Main[2B], Communication[5B]), SD_D0 (bidir, see EMP_FC_Main[2B], Communication[5B]), SD_D1 (bidir, see EMP_FC_Main[2B], Communication[5B]), SD_D2 (bidir, see EMP_FC_Main[2B], Communication[5B]), SD_D3 (bidir, see EMP_FC_Main[2B], Communication[5B]), SD_DETECT (in, see EMP_FC_Main[2B], Communication[5B]), SWDCLK (out, see EMP_FC_Main[3B], Communication[8A]), SWDIO (bidir, see EMP_FC_Main[3B], Communication[8A]), UART3_RX (in, see EMP_FC_Main[2B], Communication[7C]), UART3_TX (out, see EMP_FC_Main[2B], Communication[7C]), UART8_RX (in, see EMP_FC_Main[2C], Motor_Outputs[3B]), USART1_RX (in, see EMP_FC_Main[3C], Communication[6D]), USART1_TX (out, see EMP_FC_Main[3C], Communication[6D]), USART2_RX (in, see EMP_FC_Main[3C], Communication[8B]), USB+ (in, see EMP_FC_Main[3B], Communication[4B]), USB- (in, see EMP_FC_Main[3C], Communication[4A])

### Nets
+3V3_ANALOG: A1.1(VDD) A1.2(PS) C11.1 C12.1 C13.1 C24.1 C25.1 C26.1 C27.1 C30.1 C31.1 C35.1 C36.1 C37.1 C38.1 R19.2 R24.1 R25.1 R26.2 R27.2 U3.20(VREF+) U3.21(VDDA) U4.5(VDDIO) U4.8(VDD) U6.3(VDD) U6.11(VDDIO)
+3V3_MAIN: C14.1 C15.1 C16.1 C17.1 C18.1 C19.1 C20.1 C32.1 C33.1 C34.1 R20.1 R21.2 R22.2 R23.2 S1.1 U3.6(VBAT) U3.11(VDD) U3.27(VDD) U3.50(VDD) U3.75(VDD) U3.100(VDD) U5.8(VDD)
GND: A1.3(GND) A1.4(~{CSB}) A1.5(~{CSB}) C9.2 C10.2 C11.2 C12.2 C13.2 C14.2 C15.2 C16.2 C17.2 C18.2 C19.2 C20.2 C21.1 C22.1 C23.2 C24.2 C25.2 C26.2 C27.2 C28.1 C29.1 C30.2 C31.2 C32.2 C33.2 C34.2 C35.2 C36.2 C37.2 C38.2 D6.1(C) R18.1 S2.2 U3.10(VSS) U3.19(VSSA) U3.26(VSS) U3.49(VSS) U3.74(VSS) U3.99(VSS) U4.6(GND) U4.7(RESV_7) U5.4(VSS) U5.9(EXP) U6.2(NC) U6.4(GNDA) U6.6(GNDIO) U6.7(PS)
BMI_CSB1: R27.1 U3.39(PE9) U6.14(CSB1)
BMI_CSB2: R26.1 U3.40(PE10) U6.5(CSB2)
BMI_INT(GYRO): U3.38(PE8) U6.12(INT3)
GPS_SCL: U3.95(PB8) ; port GPS_SCL
GPS_SDA: U3.96(PB9) ; port GPS_SDA
ICM42INT: U3.37(PE7) U4.4(INT1/INT)
MCU_STATUS: R17.2 U3.84(PD3)
NRST: C23.1 R20.2 S2.1 U3.14(~{RST}) ; port NRST
RX: U3.97(PE0) ; port UART8_RX
SCL: A1.8(SCLK) R25.2 U3.46(PB10)
SD_CLK: U3.79(PC11) ; port SD_CLK
SD_CMD: U3.83(PD2) ; port SD_CMD
SD_D1: U3.65(PC8) ; port SD_D1
SD_D2: U3.66(PC9) ; port SD_D2
SD_D3: U3.78(PC10) ; port SD_D3
SD_DETECT: U3.7(PC13) ; port SD_DETECT
SD_DO: U3.64(PC7) ; port SD_D0
SDA: A1.7(SDI/SDA) R24.2 U3.47(PB11)
SPI1_CS: R22.1 U3.28(PA4) U5.1(~{CS})
SPI1_MISO: U3.90(PB4) U5.2(SO)
SPI1_MOSI: U3.91(PB5) U5.5(SI)
SPI1_SCLK: U3.89(PB3) U5.6(SCK)
SPI2_CS: R19.1 U3.51(PB12) U4.12(AP_CS)
SPI2_MISO: U3.53(PB14) U4.1(AP_SDO/AP_AD0)
SPI2_MOSI: U3.54(PB15) U4.14(AP_SDA/AP_SDIO/AP_SDI)
SPI2_SCLK: R16.2 U4.13(AP_SCL/AP_SCLK)
SPI4_MISO: U3.43(PE13) U6.10(SDO2) U6.15(SDO1)
SPI4_MOSI: U3.44(PE14) U6.9(SDA/SDI)
SPI4_SCLK: R15.2 U6.8(SCL/SCK)
SWCLK: U3.76(PA14) ; port SWDCLK
SWDIO: U3.72(PA13) ; port SWDIO
UART3_RX: U3.56(PD9) ; port UART3_RX
UART3_TX: U3.55(PD8) ; port UART3_TX
USART1_RX: U3.69(PA10) ; port USART1_RX
USART1_TX: U3.68(PA9) ; port USART1_TX
USB_N: U3.70(PA11) ; port USB-
USB_P: U3.71(PA12) ; port USB+
NetC9_1: C9.1 U3.48(VCAP)
NetC10_1: C10.1 U3.73(VCAP)
NetC21_2: C21.2 U3.12(PH0-OSC_IN) Y1.3
NetC22_2: C22.2 U3.13(PH1-OSC_OUT) Y1.1
NetC28_2: C28.2 U3.8(PC14-OSC32_IN) Y2.1
NetC29_2: C29.2 U3.9(PC15-OSC32_OUT) Y2.2
NetC39_1: U3.29(PA5) ; port CURR
NetD6_2: D6.2(A) R17.1
NetJ8_1: U3.59(PD12) ; port POWER_SCL
NetJ8_2: U3.60(PD13) ; port POWER_SDA
NetR11_1: U3.87(PD6) ; port USART2_RX
NetR15_1: R15.1 U3.42(PE12)
NetR16_1: R16.1 U3.52(PB13)
NetR18_2: R18.2 S1.2 U3.94(BOOT0)
NetR21_1: R21.1 U5.3(~{WP})
NetR23_1: R23.1 U5.7(~{HOLD})
NetR29_1: U3.22(PA0) ; port PWM1
NetR30_1: U3.23(PA1) ; port PWM2
NetR31_1: U3.24(PA2) ; port PWM3
NetR32_1: U3.25(PA3) ; port PWM4
NetU2_1: U3.82(PD1) ; port CAN_TX1
NetU2_4: U3.81(PD0) ; port CAN_RX1

Not connected (* = marked no-connect by the designer): A1 6(SDO)*; U3 1(PE2)* 2(PE3)* 3(PE4)* 4(PE5)* 5(PE6)* 15(PC0)* 16(PC1)* 17(PC2_C)* 18(PC3_C)* 30(PA6)* 31(PA7)* 32(PC4)* 33(PC5)* 34(PB0)* 35(PB1)* 36(PB2)* 41(PE11)* 45(PE15)* 57(PD10)* 58(PD11)* 61(PD14)* 62(PD15)* 63(PC6)* 67(PA8)* 77(PA15)* 80(PC12)* 85(PD4)* 86(PD5)* 88(PD7)* 92(PB6)* 93(PB7)* 98(PE1)*; U4 2(RESV_2)* 3(RESV_3)* 9(INT2/FSYNC/CLKIN) 10(RESV_10)* 11(RESV_11)*; U6 1(INT2)* 13(INT4)* 16(INT1)*

### Layout directives
differential pair: USB_N, USB_P

### Notes on the sheet
- STM ESC OUTPUTS
- STM POWER DECOPLING CAPACITORS

### Library data of the parts
A1 = MS561101BA03-50: Sensor;MS5611-BT M-CAPS 3X5X1MM T&R;Pressure;MS561101BA03-50 | TE Connectivity MS561101BA03-50; SnapEDA_Link: https://www.snapeda.com/parts/MS561101BA03-50/TE+Connectivity+ALCOSWITCH+Switches/view-part/?ref=snap; Package: SMD-8 Measurement Specialties; Value: *; MF: TE Connectivity; MP: MS561101BA03-50; Check_prices: https://www.snapeda.com/parts/MS561101BA03-50/TE+Connectivity+ALCOSWITCH+Switches/view-part/?ref=eda
C9 C10 C26 C31 = CMP-06035-048202-1: Chip Multilayer Ceramic Capacitors for General Purpose, 0402, 2.2uF, X7R, 15%, 10%, 10V
C11 C12 C14-C19 C23-C25 C30 C32 C35 C37 = CMP-03020-002733-1: as C52 on sheet Power_Management; ComponentLink2Description: Datasheet; Automotive: No; Digikey Description: CAP CER 0.1UF 10V X7R 0402; Temperature Range Low: -55°C; Ipc Land Pattern Name: CAPC10050X50; Lead Free: Yes; Category: Cap; Package: C0402-BB; Octopart: https://octopart.com/c0402c104k8racauto-kemet-9145167; Voltage Rating: 10 V; Device Class L2: Capacitors; Capacitance: 0.10 μF; Temperature Range High: +125°C; Height: 0.55mm; ComponentLink2URL: https://content.kemet.com/datasheets/KEM_C1002_X7R_SMD.pdf; Temperature: -55°C to +125°C; Device Class L1: Passive Components; Temperature Characteristic: X7R; RoHS: TRUE; Device Class L3: Ceramic Capacitors
C13 C27 C33 C36 C38 = CMP-06035-009893-1: Chip Multilayer Ceramic Capacitors for General Purpose, 0402, 1.0uF, X7R, 15%, 20%, 6.3V
C20 C34 = CMP-06035-058540-1: as C46 on sheet Power_Management
C21 C22 = CMP-03020-024161-1: C0402 18 pF X8R 5.00% 50 V; Manufacturer: Kemet; Manufacturer Part Number: C0402C180J5HACAUTO; Material: Ceramic; Temperature Coefficient: 15%; Tolerance: 0.05; Voltage Rating: 50 V; Temperature Range Low: -55°C; Octopart: https://octopart.com/c0402c180j5hacauto-kemet-88080534; Device Class L1: Passive Components; Automotive: No; ComponentLink2Description: Datasheet; RoHS: TRUE; Category: Cap; Package: C0402-BB; Temperature Characteristic: X8R; Ipc Land Pattern Name: CAPC10050X50; Temperature Range High: +125°C; Value: 18 pF; Capacitance: 18 pF; Device Class L3: Ceramic Capacitors; ComponentLink2URL: https://content.kemet.com/datasheets/KEM_C1002_X7R_SMD.pdf; Height: 0.55mm; Device Class L2: Capacitors; Temperature: -55°C to +125°C; Lead Free: Yes
C28 C29 = CMP-03020-024996-1: C0402 12 pF X8R 5.00% 50 V; Manufacturer: Kemet; Manufacturer Part Number: C0402C120J5HACTU; Tolerance: 0.05; Temperature Coefficient: 15%; Voltage Rating: 50 V; Material: Ceramic; Device Class L2: Capacitors; Temperature Range Low: -55°C; Temperature Range High: +125°C; Temperature Characteristic: X8R; Device Class L3: Ceramic Capacitors; ComponentLink2Description: Datasheet; Capacitance: 12 pF; Height: 0.55mm; Category: Cap; Package: C0402-BB; Ipc Land Pattern Name: CAPC10050X50; RoHS: TRUE; Lead Free: Yes; Automotive: No; Octopart: https://octopart.com/c0402c120j5hactu-kemet-88724098; Temperature: -55°C to +125°C; Device Class L1: Passive Components; Value: 12 pF; ComponentLink2URL: https://content.kemet.com/datasheets/KEM_C1002_X7R_SMD.pdf
D6 = CMP-22017-000007-1: LED GREEN CLEAR CHIP SMD; Luminous Intensity: 12mcd; Lens Color: Colorless; Dominant Wavelength: 569nm; Number of LEDs: 1; Power Dissipation: 100mW; Viewing Angle: 130°; Reverse Voltage: 5V; Test Current: 10mA; Forward Voltage: 2.1V; Wavelength: 585nm; Lens Style: Diffused; Forward Current: 30mA; Height: 0.8mm; Mount: Surface Mount; Package Quantity: 1; Length: 2mm; Case Code (Metric): 2012; Number of Pins: 2; Number of Elements: 1; Packaging: Tape and Reel; Color: Green; Min Operating Temperature: -55°C; Case/Package: 0805; Power Rating: 100mW; Max Operating Temperature: 85°C; Radiation Hardening: No; Depth: 1.25mm; Lens Transparency: Clear; Width: 1.25mm; Lead Free: Lead Free; Case Code (Imperial): 0805; Illumination Color: Green
R15 R16 = CMP-26527-006952-1: 22Ω ±1% 0.063W 0402 Thick Film Chip Resistor AEC-Q200 compliant; Temperature Coefficient: 100ppm/°C; Resistance: 22R; Max Power Dissipation: 63mW; RoHS Compliant: Yes; Min Operating Temperature: -55°C; Features: Automotive AEC-Q200; Max Operating Temperature: 155°C; Number of Terminations: 2; Length: 0.039inch; Height: 0.016inch; Tolerance: 1%; Packaging: Tape and Reel; Width: 0.02inch; Resistor Type: Thick Film; Contact Plating: Tin; Case/Package: 0402; Series: RMCF; Mount: Surface Mount
R17 = CMP-02407-001712-1: as R42 on sheet Power_Management; Case Code (Metric): 1005; Min Operating Temperature: -55°C; Max Operating Temperature: 175°C; Features: Automotive AEC-Q200; Composition: Thin Film; Case Code (Imperial): 0402; Number of Terminations: 2; Case/Package: 0402; Packaging: Cut Tape
R18-R27 = CMP-02407-000363-1: RES SMD 1.2K OHM 1% 1/10W 0402; Power Rating: 100mW; Temperature Coefficient: 25ppm/°C; Tolerance: 0.5%; Voltage Rating: 50V; Resistance: 10kR; Package Quantity: 10000; Case Code (Metric): 1005; Height: 0.015inch; Termination: SMD/SMT; Features: Automotive AEC-Q200; Packaging: Tape and Reel; Length: 0.039inch; Min Operating Temperature: -55°C; Case/Package: 0402; Max Power Dissipation: 100mW; Case Code (Imperial): 0402; Width: 0.5mm; Contact Plating: Tin; Weight: 2.1E-05oz; Max Operating Temperature: 175°C; Composition: Thin Film; Number of Terminations: 2; Radiation Hardening: No
S1 S2 = TL1015AF160QG: Tactile Switch SPST-NO Top Actuated Surface Mount; Package: None; Availability: Unavailable; Value: *; MP: TL1015AF160QG; Price: None
U3 = CMP-12105-000050-1: IC MCU 32BIT 2MB FLASH 100LQFP; Manufacturer: STMicroelectronics; Number Of Ethernet Channels: 1; Number Of Usb Channels: 2; Number Of A/D Converters: 3; Min Supply Voltage: 1.71V; Ram Size: 1060KBytes; Number Of I2C Channels: 4; Frequency: 480MHz; Number Of Adc Channels: 36; Number Of I/Os: 82; Max Supply Voltage: 3.6V; Number Of Spi Channels: 6; Memory Size: 2MBytes; Max Junction Temp: +125°C; Core Architecture: Arm Cortex-M7; Interface: I2C,SPI,UART,USART,USB,LIN,IrDA,Ethernet,I2S,Other; Number Of Timers/Counters: 20; Data Bus Width: 32bits; Number Of Pwm Channels: 42; Number Of Uart Channels: 9; Standoff Height: 0.05mm; Device Class L1: Integrated Circuits (ICs); ComponentLink2URL: https://www.st.com/resource/en/datasheet/stm32h743vi.pdf; Automotive: No; Memory Type: FLASH; Number Of Cores: 1; Temperature Range Low: -40°C; RoHS: TRUE; Ambient Temperature Range Low: -40°C; ComponentLink2Description: Datasheet; Device Class L2: Embedded Processors and Controllers; Device Class L3: Microcontrollers; Digikey Description: IC MCU 32BIT 2MB FLASH 100LQFP; Temperature Range High: +125°C; Ambient Temperature Range High: +85°C; Package: LQFP100-1L; Temperature: -40°C to +125°C; Category: IC; Ipc Land Pattern Name: QFP50P1600X1600X160-100; Height: 1.6mm; Manufacturer Part Number: STM32H743VIT6; Octopart: https://octopart.com/stm32h743vit6-stmicroelectronics-76372527; Lead Free: Yes
U4 = ICM-42688-P: Accelerometer, Gyroscope, 6 Axis Sensor Output; Package: None; MP: ICM-42688-P; Value: *; Availability: Unavailable; Price: None
U5 = FM25V02A-DG: FRAM (Ferroelectric RAM) Memory IC 256Kb (32K x 8) SPI 40 MHz 8-DFN (4x4.5); MF: Cypress Semiconductor; SnapEDA_Link: https://www.snapeda.com/parts/FM25V02A-DG/Infineon/view-part/?ref=snap; Package: TDFN-8 Cypress Semiconductor; Value: *; MP: FM25V02A-DG; Check_prices: https://www.snapeda.com/parts/FM25V02A-DG/Infineon/view-part/?ref=eda
U6 = BMI088: High-performance 6-axis inertial sensor (accelerometer + gyroscope) <a href="https://pricing.snapeda.com/parts/BMI088/Bosch%20Sensortec/view-part?ref=eda">Check prices</a>; Package: None; MP: BMI088; Value: *; Availability: Unavailable; Price: None
Y1 = SXT32412BB07-25.000MT: 25 MHz Â±30ppm Crystal 12pF 50 Ohms 4-SMD, No Lead; MF: Suntsu; SnapEDA_Link: https://www.snapeda.com/parts/SXT32412BB07-25.000M/Suntsu/view-part/?ref=snap; Package: NON STANDARD-4 Suntsu; Value: *; MP: SXT32412BB07-25.000M; Check_prices: https://www.snapeda.com/parts/SXT32412BB07-25.000M/Suntsu/view-part/?ref=eda; Supplier 1: DigiKey; Supplier Part Number 1: 535-ABM8N-25.0000MHZ-12-B1U-T3CT-ND
Y2 = CMP-0447-00001-4: Crystal 32.768kHz ±20ppm (Tol) 12.5pF FUND 70kΩ 2-Pin CSMD T/R; ESR (Equivalent Series Resistance): 70kR; Radiation Hardening: No; Frequency: 32.768kHz; Length: 3.2mm; Max Operating Temperature: 85°C; Number of Pins: 2; Series: ABS07; Min Operating Temperature: -40°C; Frequency Tolerance: 20ppm; Packaging: Tape and Reel; Height: 0.9mm; Width: 1.5mm; Depth: 1.5mm; Load Capacitance: 12.5pF; RoHS Compliant: Yes; Tolerance: 20ppm; Termination: SMD/SMT; Lead Free: Lead Free; Series Resistance: 70kR; REACH SVHC: No SVHC; Case/Package: CSMD; Operating Frequency: 32.768 kHz; Package Quantity: 3000

## Sheet Communication.SchDoc
size A3; SheetNumber: 4; SheetTotal: 5
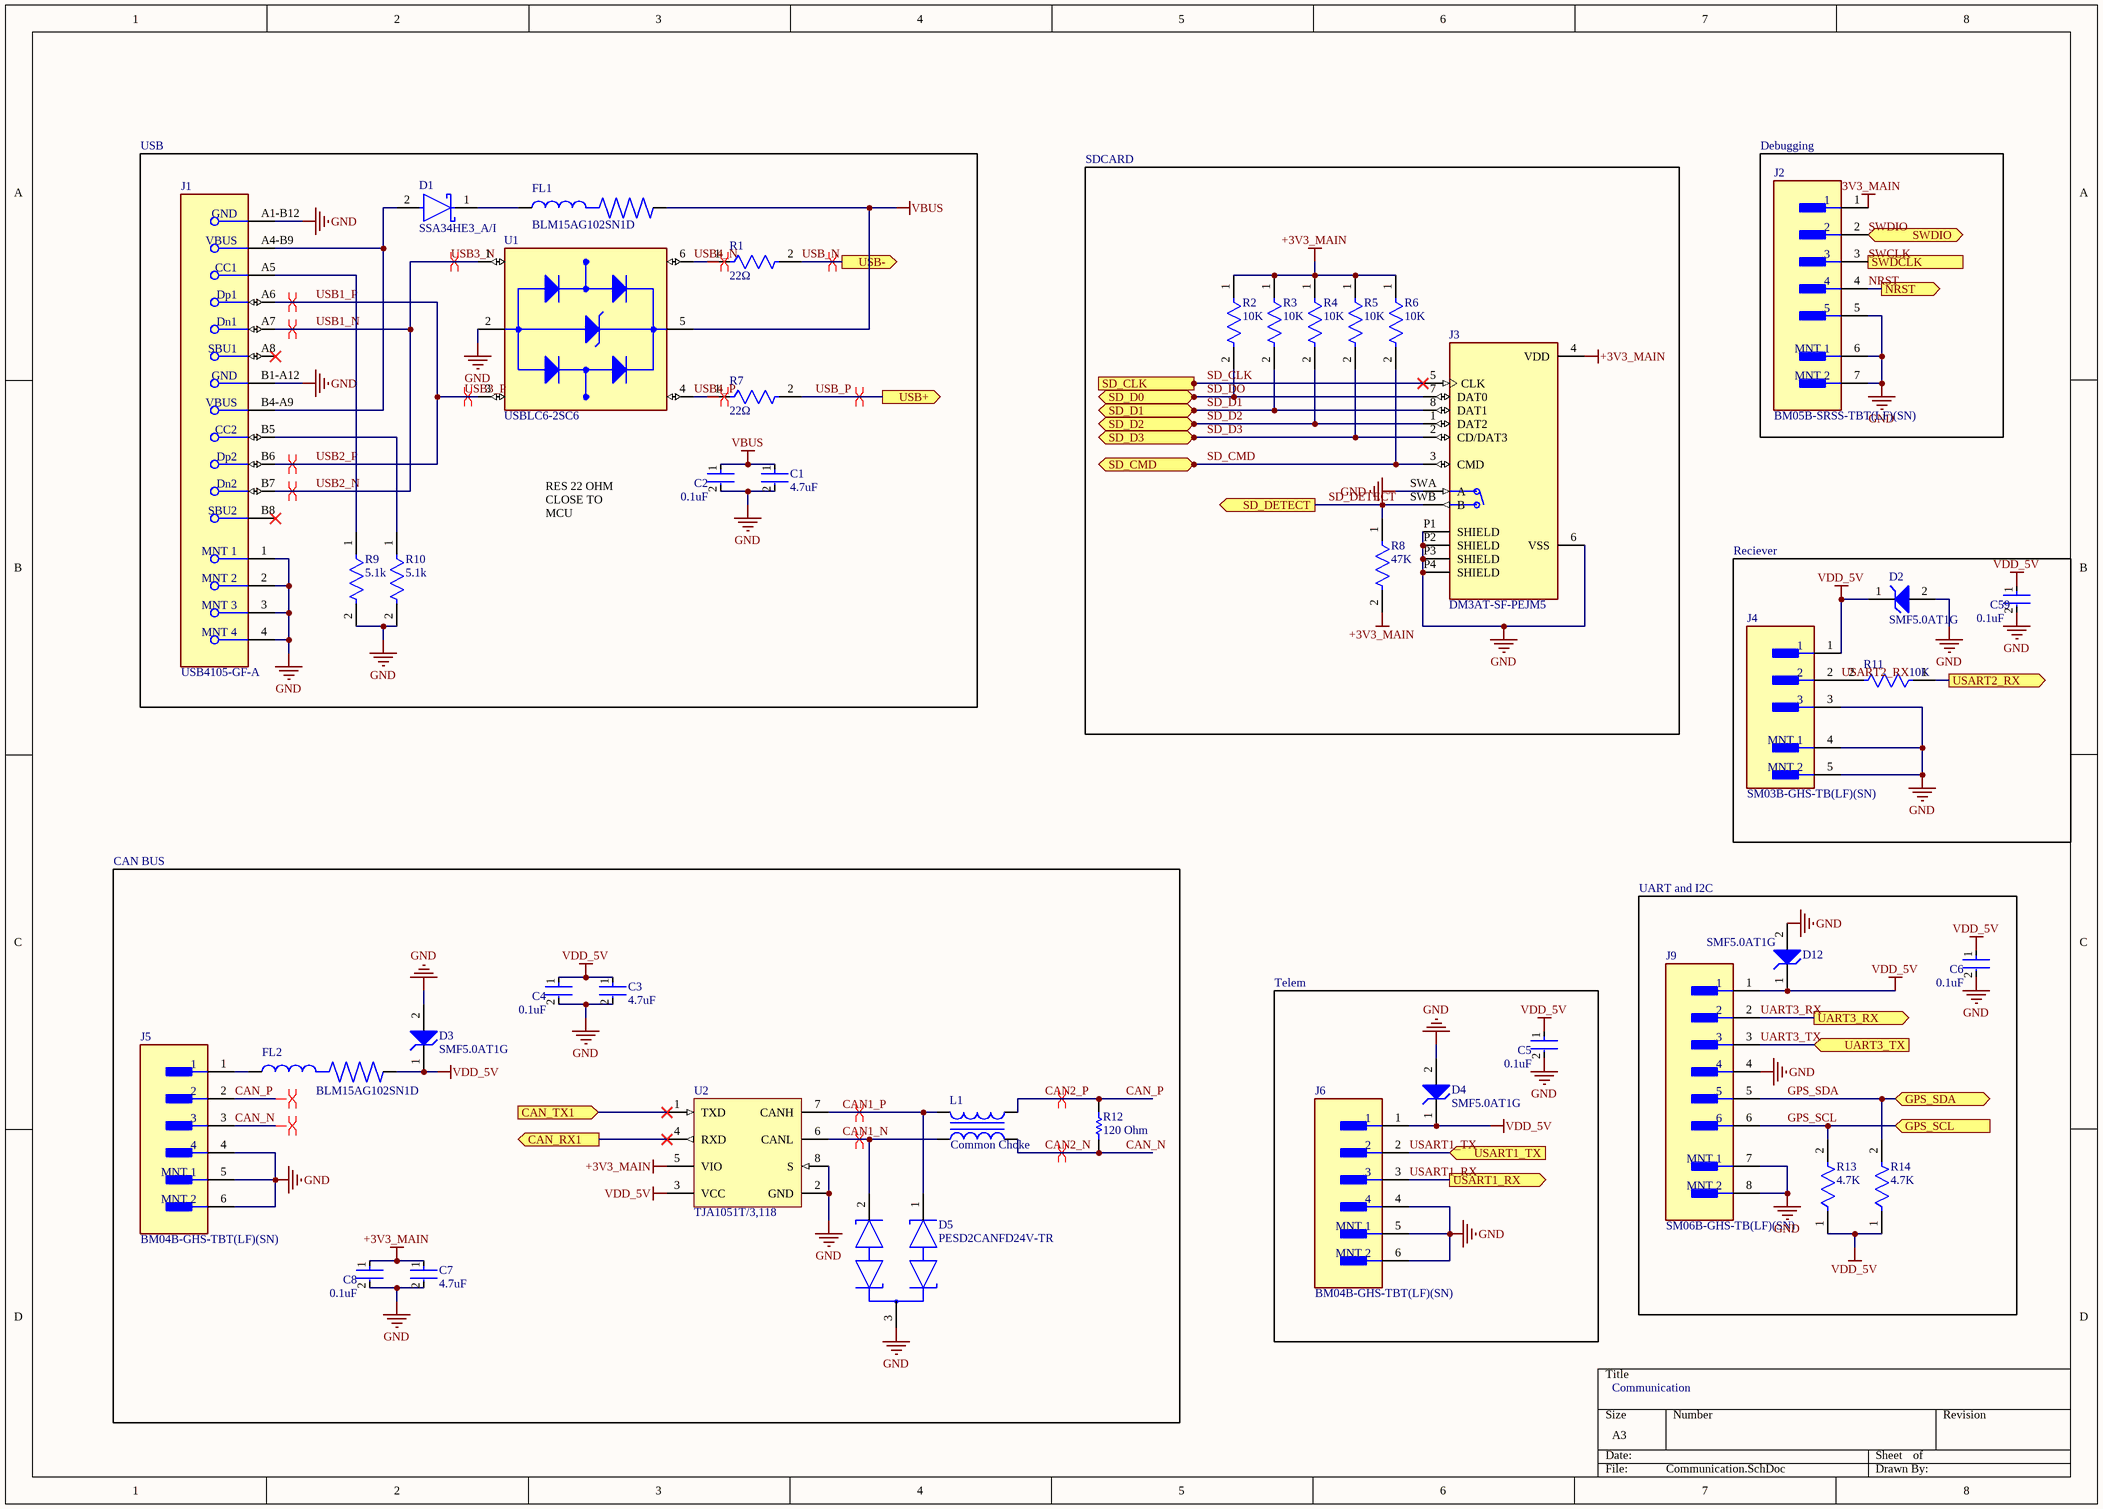
[diagram p3: Communication.SchDoc]

### Parts
C1  4.7uF  [FP-GRT155-0_15-MFG]
C2  0.1uF  [FP-C0402-BB-MFG]
C3  4.7uF  [FP-GRT155-0_15-MFG]
C4  0.1uF  [FP-C0402-BB-MFG]
C5  0.1uF  [FP-C0402-BB-MFG]
C6  0.1uF  [FP-C0402-BB-MFG]
C7  4.7uF  [FP-GRT155-0_15-MFG]
C8  0.1uF  [FP-C0402-BB-MFG]
C59  0.1uF  [FP-C0402-BB-MFG]
D1  SSA34HE3_A/I  [FP-95400-MFG]
D2  SMF5.0AT1G  [ONSC-SOD-123FL-2-498_V]
D3  SMF5.0AT1G  [ONSC-SOD-123FL-2-498_V]
D4  SMF5.0AT1G  [ONSC-SOD-123FL-2-498_V]
D5  PESD2CANFD24V-TR  [FP-SOT23-IPC_A]
D12  SMF5.0AT1G  [ONSC-SOD-123FL-2-498_V]
FL1  BLM15AG102SN1D  [BEADC1005X55N]
FL2  BLM15AG102SN1D  [BEADC1005X55N]
J1  USB4105-GF-A  [FP-USB4105-GF-A-MFG]
J2  BM05B-SRSS-TBT(LF)(SN)  [FP-BM05B-SRSS-TBT_LF_SN-MFG]
J3  DM3AT-SF-PEJM5  [HRS_DM3AT-SF-PEJM5]
J4  SM03B-GHS-TB(LF)(SN)  [FP-SM03B-GHS-TB_LF_SN-MFG]
J5  BM04B-GHS-TBT(LF)(SN)  [FP-BM04B-GHS-TBT_LF_SN-MFG]
J6  BM04B-GHS-TBT(LF)(SN)  [FP-BM04B-GHS-TBT_LF_SN-MFG]
J9  SM06B-GHS-TB(LF)(SN)  [FP-SM06B-GHS-TB_LF_SN-MFG]
L1  Common Choke  [TDK-ACT45B-510-2P-TL003-4_V]
R1  22Ω  [FP-RMCF0402-MFG]
R2  10K  [FP-MCS0402-MFG]
R3  10K  [FP-MCS0402-MFG]
R4  10K  [FP-MCS0402-MFG]
R5  10K  [FP-MCS0402-MFG]
R6  10K  [FP-MCS0402-MFG]
R7  22Ω  [FP-RMCF0402-MFG]
R8  47K  [FP-CRCW0402-e3-IPC_B]
R9  5.1k  [FP-RN73R1E-IPC_C]
R10  5.1k  [FP-RN73R1E-IPC_C]
R11  10K  [FP-MCS0402-MFG]
R12  120 Ohm  [RESC1005X40X25NL05T10]
R13  4.7K  [FP-CRCW0402-Pe3-IPC_C]
R14  4.7K  [FP-CRCW0402-Pe3-IPC_C]
U1  USBLC6-2SC6  [SOT95P280X145-6N]
U2  TJA1051T/3,118  [NXP-SOIC-8_L]

### Blocks framed on the sheet
USB: C1 C2 D1 FL1 J1 R1 R7 R9 R10 U1
SDCARD: J3 R2-R6 R8
Debugging: J2
Reciever: C59 D2 J4 R11
CAN BUS: C3 C4 C7 C8 D3 D5 FL2 J5 L1 R12 U2
Telem: C5 D4 J6

### Ports
CAN_RX1 (out, see EMP_FC_Main[2B], MCU_Core[1A]), CAN_TX1 (in, see EMP_FC_Main[2B], MCU_Core[1A]), GPS_SCL (in, see EMP_FC_Main[3A], MCU_Core[5B]), GPS_SDA (bidir, see EMP_FC_Main[3A], MCU_Core[5B]), NRST (out, see EMP_FC_Main[3B], MCU_Core[1B]), SD_CLK (in, see EMP_FC_Main[2B], MCU_Core[4C]), SD_CMD (bidir, see EMP_FC_Main[2B], MCU_Core[1A]), SD_D0 (bidir, see EMP_FC_Main[2B], MCU_Core[4B]), SD_D1 (bidir, see EMP_FC_Main[2B], MCU_Core[4B]), SD_D2 (bidir, see EMP_FC_Main[2B], MCU_Core[4C]), SD_D3 (bidir, see EMP_FC_Main[2B], MCU_Core[4C]), SD_DETECT (out, see EMP_FC_Main[2B], MCU_Core[4C]), SWDCLK (out, see EMP_FC_Main[3B], MCU_Core[4B]), SWDIO (bidir, see EMP_FC_Main[3B], MCU_Core[4B]), UART3_RX (out, see EMP_FC_Main[2B], MCU_Core[1B]), UART3_TX (in, see EMP_FC_Main[2B], MCU_Core[1A]), USART1_RX (out, see EMP_FC_Main[3B], MCU_Core[4B]), USART1_TX (in, see EMP_FC_Main[3B], MCU_Core[4B]), USART2_RX (out, see EMP_FC_Main[3A], MCU_Core[1A]), USB+ (out, see EMP_FC_Main[3B], MCU_Core[4B]), USB- (out, see EMP_FC_Main[3B], MCU_Core[4B])

### Nets
+3V3_MAIN: C7.1 C8.1 J2.1 J3.4(VDD) R2.1 R3.1 R4.1 R5.1 R6.1 R8.2 U2.5(VIO)
GND: C1.2 C2.2 C3.2 C4.2 C5.2 C6.2 C7.2 C8.2 C59.2 D2.2(A) D3.2(A) D4.2(A) D5.3(CC) D12.2(A) J1.1(MNT_1) J1.2(MNT_2) J1.3(MNT_3) J1.4(MNT_4) J1.A1-B12(GND) J1.B1-A12(GND) J2.5 J2.6(MNT_1) J2.7(MNT_2) J3.6(VSS) J3.P1(SHIELD) J3.P2(SHIELD) J3.P3(SHIELD) J3.P4(SHIELD) J3.SWA(A) J4.3 J4.4(MNT_1) J4.5(MNT_2) J5.4 J5.5(MNT_1) J5.6(MNT_2) J6.4 J6.5(MNT_1) J6.6(MNT_2) J9.4 J9.7(MNT_1) J9.8(MNT_2) R9.2 R10.2 U1.2(GND) U2.2(GND) U2.8(S)
VBUS: C1.1 C2.1 FL1.2 U1.5(VBUS)
VDD_5V: C3.1 C4.1 C5.1 C6.1 C59.1 D2.1(K) D3.1(K) D4.1(K) D12.1(K) FL2.2 J4.1 J6.1 J9.1 R13.1 R14.1 U2.3(VCC)
CAN1_N: D5.2(K2) L1.2 U2.6(CANL)
CAN1_P: D5.1(K1) L1.1 U2.7(CANH)
CAN2_N: J5.3 L1.3 R12.1  [also labelled CAN_N]
CAN2_P: J5.2 L1.4 R12.2  [also labelled CAN_P]
GPS_SCL: J9.6 R13.2 ; port GPS_SCL
GPS_SDA: J9.5 R14.2 ; port GPS_SDA
NRST: J2.4 ; port NRST
SD_CLK: J3.5(CLK) ; port SD_CLK
SD_CMD: J3.3(CMD) R6.2 ; port SD_CMD
SD_D1: J3.8(DAT1) R3.2 ; port SD_D1
SD_D2: J3.1(DAT2) R4.2 ; port SD_D2
SD_D3: J3.2(CD/DAT3) R5.2 ; port SD_D3
SD_DETECT: J3.SWB(B) R8.1 ; port SD_DETECT
SD_DO: J3.7(DAT0) R2.2 ; port SD_D0
SWCLK: J2.3 ; port SWDCLK
SWDIO: J2.2 ; port SWDIO
UART3_RX: J9.2 ; port UART3_RX
UART3_TX: J9.3 ; port UART3_TX
USART1_RX: J6.3 ; port USART1_RX
USART1_TX: J6.2 ; port USART1_TX
USART2_RX: J4.2 R11.2
USB1_N: J1.A7(Dn1) J1.B7(Dn2) U1.1(I/O1_IN)  [also labelled USB2_N, USB3_N]
USB1_P: J1.A6(Dp1) J1.B6(Dp2) U1.3(I/O2_IN)  [also labelled USB2_P, USB3_P]
USB4_N: R1.1 U1.6(I/O1_OUT)
USB4_P: R7.1 U1.4(I/O2_OUT)
USB_N: R1.2 ; port USB-
USB_P: R7.2 ; port USB+
NetD1_1: D1.1(C) FL1.1
NetD1_2: D1.2(A) J1.A4-B9(VBUS) J1.B4-A9(VBUS)
NetFL2_1: FL2.1 J5.1
NetJ1_A5: J1.A5(CC1) R9.1
NetJ1_B5: J1.B5(CC2) R10.1
NetR11_1: R11.1 ; port USART2_RX
NetU2_1: U2.1(TXD) ; port CAN_TX1
NetU2_4: U2.4(RXD) ; port CAN_RX1

Not connected (* = marked no-connect by the designer): J1 A8(SBU1)* B8(SBU2)*

### Layout directives
differential pair: CAN1_N, CAN1_P, CAN2_N, CAN2_P, USB1_N, USB1_P, USB4_N, USB4_P, USB_N, USB_P

### Notes on the sheet
- RES 22 OHM CLOSE TO MCU
- UART and I2C
- Communication

### Library data of the parts
C1 C3 C7 = CMP-06035-058540-1: as C46 on sheet Power_Management
C2 C4-C6 C8 C59 = CMP-03020-002733-1: as C52 on sheet Power_Management; ComponentLink2Description: Datasheet; Automotive: No; Digikey Description: CAP CER 0.1UF 10V X7R 0402; Temperature Range Low: -55°C; Ipc Land Pattern Name: CAPC10050X50; Lead Free: Yes; Category: Cap; Package: C0402-BB; Octopart: https://octopart.com/c0402c104k8racauto-kemet-9145167; Voltage Rating: 10 V; Device Class L2: Capacitors; Capacitance: 0.10 μF; Temperature Range High: +125°C; Height: 0.55mm; ComponentLink2URL: https://content.kemet.com/datasheets/KEM_C1002_X7R_SMD.pdf; Temperature: -55°C to +125°C; Device Class L1: Passive Components; Temperature Characteristic: X7R; RoHS: TRUE; Device Class L3: Ceramic Capacitors
D1 = CMP-02539-000063-1: DIODE SCHOTTKY 40V 3A DO214AC; Forward Voltage: 380mV; Peak Non-Repetitive Surge Current: 75A; Element Configuration: Single; Max Reverse Current: 17mA; Radiation Hardening: No; Max Operating Temperature: 150°C; Min Operating Temperature: -65°C; Packaging: Tape and Reel; Case/Package: DO-214AC; Forward Current: 3A; Series: Automotive, AEC-Q101; Max Repetitive Reverse Voltage (Vrrm): 40V; Average Rectified Current: 3A; Mount: Surface Mount; Reverse Voltage (DC): 40V; Package Quantity: 7500; RoHS Compliant: Yes; Max Reverse Voltage (DC): 40V; Max Forward Surge Current (Ifsm): 75A
D2-D4 D12 = CMP-1061-00612-1: 200 W Transient Voltage Suppressor, 2-Pin SOD-123FL, Pb-Free, Tape and Reel; Manufacturer: On Semiconductor; Direction: Unidirectional; IR Max (uA): 400; V(BR) Typ (V): 6.7; PackageDescription: 2-Pin SOD, Body 1.65 x 2.7 mm; PartNumber: SMF5.0AT1G; ComponentLink3Description: Package Specification; ComponentLink3URL: http://www.onsemi.com/pub_link/Collateral/498-01.PDF; PackageVersion: Rev. D, 05/2013; Mounting Technology: Surface Mount; PackageReference: SOD-123FL-2-498; ComponentLink2URL: http://www.onsemi.com/pub_link/Collateral/SMF5.0AT1-D.PDF; DatasheetVersion: Rev. 7; ComponentLink1Description: Manufacturer URL; Packing: Tape and Reel; RoHS: Pb-Free; ComponentLink1URL: http://www.onsemi.com/; ComponentLink2Description: Datasheet
D5 = CMP-14436-000014-1: TVS DIODE 24VWM 42VC TO236AB
FL1 FL2 = BLM15AG102SN1D: MF: Murata; Package: None; Price: None; Value: *; MP: BLM15AG102SN1D; Availability: Unavailable
J1 = CMP-245163-000001-1: CONN RCPT USB2.0 TYPEC 5A; Manufacturer: GCT; Voltage Rating: 20V; Is Female: yes; Current Rating: 5/6.25/1.25/0.25A; Number Of Contacts: 16; Conn Orientation: Right Angle; Device Class L1: Connectors; Category: Conn; Lead Free: Yes; RoHS: TRUE; Temperature Range High: +85°C; Digikey Description: CONN RCPT USB2.0 TYPEC 5A; Device Class L3: unset; ComponentLink2Description: Datasheet; Manufacturer Part Number: USB4105-GF-A; Package: 0; Usb Standard: USB 2.0; Device Class L2: USB Connectors; Automotive: No; Temperature Range Low: -40°C; Height: 3.46mm; Temperature: -40°C to +85°C; Contact Material: Gold,Nickel; ComponentLink2URL: https://gct.co/files/drawings/usb4105.pdf; Octopart: https://octopart.com/usb4105-gf-a-gct-106627878
J2 = CMP-17439-000266-1: CONN HEADER SMD 5POS 1MM; Voltage Rating: 50V; Number of Positions: 5; Mated Stacking Heights: 4.9mm; Pitch: 0.039inch; Connector Type: Header; Insulation Material: Nylon; Contact Material: Copper Alloy; Termination: Solder; Insulation Color: Natural; Color: Natural; Number of Rows: 1; Series: SR; Lead Free: Lead Free; Mount: Surface Mount; Package Quantity: 1500; Fastening Type: Pull; Max Operating Temperature: 85°C; Contact Shape: Square; Contact Type: Male Pin; Min Operating Temperature: -25°C; Contact Plating: Tin; Flammability Rating: UL94 V-0; Packaging: Cut Tape; Contact Finish - Mating: TIN
J3 = DM3AT-SF-PEJM5: 10 (8 + 2) Position Card Connector Secure Digital - microSDâ„¢ Surface Mount, Right Angle Gold; MF: Hirose; SnapEDA_Link: https://www.snapeda.com/parts/DM3AT-SF-PEJM5/Hirose+Electric+Co+Ltd/view-part/?ref=snap; Package: None; Value: *; MP: DM3AT-SF-PEJM5; Check_prices: https://www.snapeda.com/parts/DM3AT-SF-PEJM5/Hirose+Electric+Co+Ltd/view-part/?ref=eda
J4 = CMP-17439-000068-1: as J8 on sheet Power_Management; Orientation: Right Angle; REACH SVHC: No SVHC; Insulation Color: Natural; Housing Material: Nylon; Mount: Surface Mount; Flammability Rating: UL94 V-0; Color: Natural; Number of Rows: 1; Housing Color: Natural; Termination: Solder; Voltage Rating (AC): 50V; Max Operating Temperature: 85°C; Connector Type: Header; Series: GH; Packaging: Tape and Reel; Contact Finish - Mating: TIN; Lead Free: Lead Free; Fastening Type: Ramp; Contact Plating: Tin; Contact Material: Bronze; Insulation Material: Nylon; Contact Type: Outer Shroud Contact; Number of Contacts: 3; Min Operating Temperature: -25°C; Contact Shape: Rectangular
J5 J6 = CMP-17439-000062-2: CONN HEADER SMD 4POS 1.25MM; Number of Positions: 4; Wire/Cable Gauge: 26AWG; Current Rating: 1A; Voltage Rating (AC): 50V; Gender: Male; Orientation: Straight; Max Operating Temperature: 85°C; Pitch: 1.25mm; Contact Plating: Tin; Number of Rows: 4; Series: GH; Min Operating Temperature: -25°C; REACH SVHC: No SVHC; Packaging: Cut Tape; Lead Free: Lead Free; Voltage Rating: 50V; Contact Material: Bronze; Number of Contacts: 4; Termination: Crimp; Case/Package: SMD/SMT; Housing Color: Natural; Housing Material: Nylon
J9 = CMP-17439-000061-1: CONN HEADER SMD R/A 6POS 1.25MM; Number of Contacts: 6; Voltage Rating: 50V; Current Rating: 1A; Connector Type: Outer Shroud Contact; Contact Resistance: 50mR; Orientation: Right Angle; Max Operating Temperature: 85°C; Mount: Surface Mount; Packaging: Tape and Reel; Contact Plating: Tin; Depth: 4.05mm; Max Voltage Rating (AC): 50V; Lead Free: Lead Free; Pitch: 1.25mm; Number of Positions: 6; Max Current Rating: 1A; Termination: Solder; Min Operating Temperature: -25°C; Housing Color: Beige; Fastening Type: Ramp; Length: 10.75mm; Color: Natural; Contact Material: Bronze; Housing Material: Polyamide; Number of Rows: 1
L1 = CMP-2000-05391-1: Common-Mode Choke for CAN Bus System, 51uH, 50 V DC, -40 to 150 degC, 4-Pin SMD, RoHS, Tape and Reel; Manufacturer: TDK; Number of Lines: 2; Impedance: 2.8kOhm; Current: 200mA; Featured Product: FerriteChipCommon-ModeFilterforCAN-BUSSystem; Inductance: 51µH; Other Names: 445-3958-6; Filter Type: Data,SignalLine; DC Resistance (DCR): 1OhmMax; Dynamic Catalog: ACTSeries; Other Drawings: ACM3225SeriesSchematic / ACT45B-xxx-2P_Footprint; Catalog Drawings: (ACM4532,ACT45B)-xxx-2P_Top / ACT45B-xxx-2P_Side / ACT45B-xxx-2P_Bottom; Package / Case: Horizontal,4PCPad; Family: CommonModeChokes; Datasheet Version: Aug-12; Height (Max): 0.118"(3.00mm); Packaging: Digi-Reel; Category: Filters; Datasheet URL: https://datasheet.ciiva.com/22726/1649098-22726290.pdf; Mounting Type: SurfaceMount; Operating Temperature: -40degC~150degC; Size / Dimension: 0.177"Lx0.126"W(4.50mmx3.20mm); Series: ACT; Manufacturer URL: http://www.tdk.com/; Standard Package: 1
R1 R7 = CMP-26527-006952-1: as R15 on sheet MCU_Core; RoHS Compliant: Yes; Min Operating Temperature: -55°C; Features: Automotive AEC-Q200; Max Operating Temperature: 155°C; Number of Terminations: 2; Length: 0.039inch; Height: 0.016inch; Tolerance: 1%; Packaging: Tape and Reel; Width: 0.02inch; Resistor Type: Thick Film; Contact Plating: Tin; Case/Package: 0402; Series: RMCF; Mount: Surface Mount
R2-R6 R11 = CMP-02407-000363-1: as R18 on sheet MCU_Core; Package Quantity: 10000; Case Code (Metric): 1005; Height: 0.015inch; Termination: SMD/SMT; Features: Automotive AEC-Q200; Packaging: Tape and Reel; Length: 0.039inch; Min Operating Temperature: -55°C; Case/Package: 0402; Max Power Dissipation: 100mW; Case Code (Imperial): 0402; Width: 0.5mm; Contact Plating: Tin; Weight: 2.1E-05oz; Max Operating Temperature: 175°C; Composition: Thin Film; Number of Terminations: 2; Radiation Hardening: No
R8 = CMP-02407-007381-1: RES Thick Film, 47kΩ, 1%, 0.063W, 100ppm/°C, 0402; Max Power Dissipation: 63mW; Resistance: 47kR; Case/Package: 0402; Contact Plating: Tin; Composition: Thick Film; Height: 0.016inch; Radiation Hardening: No; Tolerance: 1%; Length: 0.039inch; Features: Automotive AEC-Q200; Max Operating Temperature: 155°C; Temperature Coefficient: 100ppm/°C; Number of Terminations: 2; Packaging: Tape and Reel; Width: 0.02inch; Package Quantity: 50000; Min Operating Temperature: -55°C; Lead Free: Lead Free
R9 R10 = CMP-04015-008529-1: 5.1kΩ ±1% 0.063W, 1/16W Chip Resistor 0402 (1005 Metric) Moisture Resistant Thin Film
R12 = CMP-2002-07370-1: Manufacturer: Yageo / Phycomp; Part Number: RC0402FR-07120RL
R13 R14 = CMP-03613-000096-1: RES Thick Film, 4.7kΩ, 1%, 0.063W, 50ppm/°C, 0402; Resistance: 4.7kR; Max Power Dissipation: 63mW; Tolerance: 1%; Package Quantity: 10000; Case/Package: 0402; Max Operating Temperature: 155°C; RoHS Compliant: Yes; Series: CRCW-P; Resistor Type: Thick Film; Number of Terminations: 2; Min Operating Temperature: -55°C; Temperature Coefficient: 50ppm/°C; Features: Automotive AEC-Q200; Length: 0.039inch; Height: 0.016inch; Width: 0.02inch; Packaging: Tape and Reel
U1 = USBLC6-2SC6: 17V Clamp 5A (8/20Âµs) Ipp Tvs Diode Surface Mount SOT-23-6; MF: STMicroelectronics; Value: *; SnapEDA_Link: https://www.snapeda.com/parts/USBLC6-2SC6/STMicroelectronics/view-part/?ref=snap; Check_prices: https://www.snapeda.com/parts/USBLC6-2SC6/STMicroelectronics/view-part/?ref=eda; Purchase-URL: https://pricing.snapeda.com/search/part/USBLC6-2SC6/?ref=eda; Price: None; Availability: In Stock; Package: SOT-23-6 STMicroelectronics; MP: USBLC6-2SC6
U2 = CMP-2000-07245-1: High-Speed CAN Transceiver, 3 to 5 V, 8-Pin SOIC (SOT96-1), RoHS, Tape and Reel; Manufacturer: NXP; Power Down Mode: Normal/Silent; Rad Hardened: No; Number of Transceivers: 1; Supply Current: 70mA; Operating Supply Voltage (Max): 5.5V; Operating Supply Voltage (Typ): 5V; Operating Supply Voltage (Min): 4.5V; Standard Supported: ISO11898-2; Data Rate: 1Mbps; DELETED: Compliant; Operating Temperature (Min): -40C; Datasheet Version: Rev. 7, 01/2015; Pin Count: 8; Operating Temperature (Max): 125C; Package Description: 8-Pin Small Outline Integrated Circuit, Body 4.9 x 3.9 mm, Pitch 1.27 mm; Category: Transceiver; Packaging: TapeandReel; Mounting: SurfaceMount; Package Reference: SOT96-1; Operating Temperature Classification: Automotive; Mounting Technology: SurfaceMount; Package Type: SO; Manufacturer URL: http://www.nxp.com/; Datasheet URL: http://www.nxp.com/documents/data_sheet/TJA1051.pdf